# Altium project UmTRXv2.PRJPCB
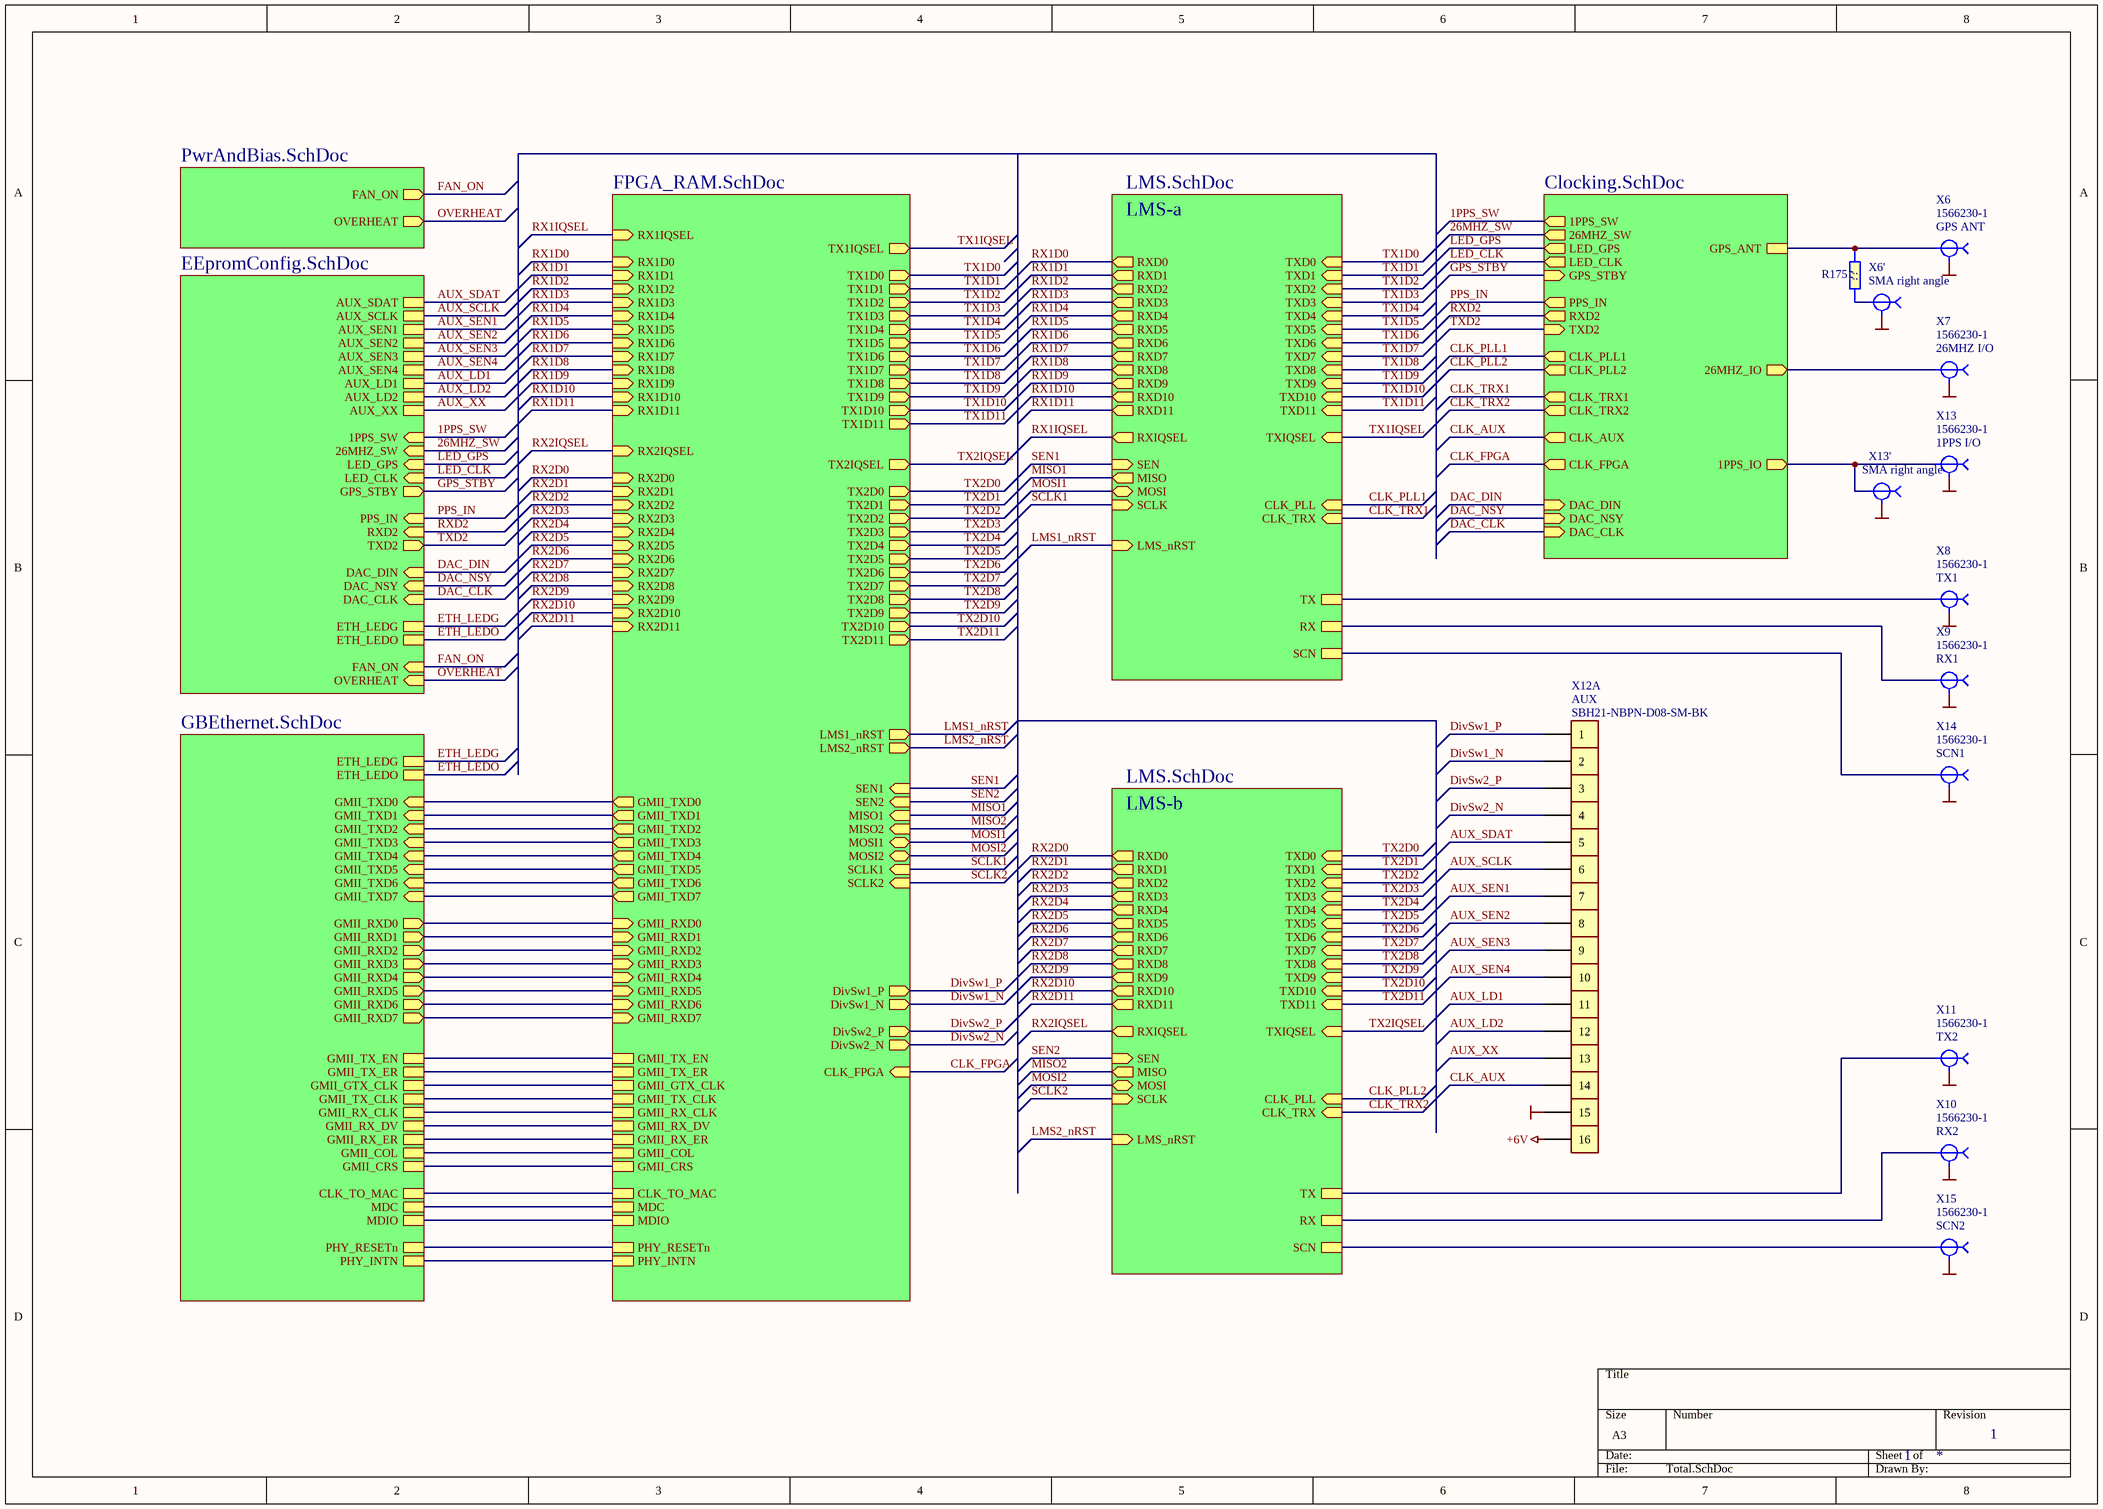
[diagram p0: Total.SchDoc]
3 sheets, 495 parts. Net scope: hierarchical (ports join the sheet entries above them; power ports are global).
Board file: UmTRXv2.PcbDoc
Sheets:
  Total.SchDoc
    PwrAndBias = PwrAndBias.SchDoc
    LMS-a = LMS.SchDoc
    LMS-b = LMS.SchDoc

## Sheet Total.SchDoc: USRP Cellular Tranceiver
size A3; Revision: 1; SheetNumber: 1; DocumentName: Fairwaves Co.

### Parts
R175  ??  [R0603-PHILLIPS]
X6  1566230-1  Dscription: GPS ANT  [U_FL]
X6'  SMA right angle  [SMA right angle]
X7  1566230-1  Dscription: 26MHZ I/O  [U_FL]
X8  1566230-1  Dscription: TX1  [U_FL]
X9  1566230-1  Dscription: RX1  [U_FL]
X10  1566230-1  Dscription: RX2  [U_FL]
X11  1566230-1  Dscription: TX2  [U_FL]
X12  SBH21-NBPN-D08-SM-BK  Misc: AUX  [SBH-16]  (parts A,B,C,D,E,F,G,H,I,J,K,L,M,N,O,P of 16)
X13  1566230-1  Dscription: 1PPS I/O  [U_FL]
X13'  SMA right angle  [SMA right angle]
X14  1566230-1  Dscription: SCN1  [U_FL]
X15  1566230-1  Dscription: SCN2  [U_FL]

### Sub-sheets
Clocking = Clocking.SchDoc (file not in this document): TXD2 (in), 26MHZ_IO (out), CLK_FPGA (out), CLK_TRX1 (out), GPS_ANT, DAC_DIN (in), DAC_NSY (in), DAC_CLK (in), PPS_IN (out), RXD2 (out), CLK_PLL1 (out), CLK_AUX (out), 1PPS_IO (out), CLK_PLL2 (out), CLK_TRX2 (out), 1PPS_SW (out), 26MHZ_SW (out), LED_GPS (out), LED_CLK (out), GPS_STBY (in)
EEpromConfig = EEpromConfig.SchDoc (file not in this document): PPS_IN (in), DAC_DIN (in), DAC_NSY (in), DAC_CLK (in), TXD2 (out), RXD2 (in), ETH_LEDG, ETH_LEDO, FAN_ON (in), OVERHEAT (in), AUX_SDAT, AUX_SCLK, AUX_SEN1, AUX_LD1, AUX_XX, AUX_SEN2, AUX_LD2, 1PPS_SW (in), 26MHZ_SW (in), LED_GPS (in), LED_CLK (in), AUX_SEN3, AUX_SEN4, GPS_STBY (out)
FPGA_RAM = FPGA_RAM.SchDoc (file not in this document): DivSw1_P (out), DivSw1_N (out), TX1IQSEL (out), TX2IQSEL (out), RX1IQSEL (in), RX2IQSEL (in), SEN1 (in), SEN2 (in), MISO1 (in), MOSI1 (bidir), SCLK1 (in), DivSw2_P (out), DivSw2_N (out), CLK_FPGA (in), CLK_TO_MAC, GMII_TX_EN, GMII_TX_ER, GMII_GTX_CLK, GMII_TX_CLK, GMII_RX_CLK, GMII_RX_DV, GMII_RX_ER, GMII_COL, GMII_CRS, MDIO, MDC, PHY_INTN, PHY_RESETn, MISO2 (in), MOSI2 (bidir), SCLK2 (in), LMS1_nRST (out), LMS2_nRST (out), TX1D0 (out), TX1D1 (out), TX1D2 (out), TX1D3 (out), TX1D4 (out), TX1D5 (out), TX1D6 (out), TX1D7 (out), TX1D8 (out), TX1D9 (out), TX1D10 (out), TX1D11 (out), TX2D0 (out), TX2D1 (out), TX2D2 (out), TX2D3 (out), TX2D4 (out), TX2D5 (out), TX2D6 (out), TX2D7 (out), TX2D8 (out), TX2D9 (out), TX2D10 (out), TX2D11 (out), RX1D0 (in), RX1D1 (in), RX1D2 (in), RX1D3 (in), RX1D4 (in), RX1D5 (in), RX1D6 (in), RX1D7 (in), RX1D8 (in), RX1D9 (in), RX1D10 (in), RX1D11 (in), RX2D0 (in), RX2D1 (in), RX2D2 (in), RX2D3 (in), RX2D4 (in), RX2D5 (in), RX2D6 (in), RX2D7 (in), RX2D8 (in), RX2D9 (in), RX2D10 (in), RX2D11 (in), GMII_TXD0 (out), GMII_TXD1 (out), GMII_TXD2 (out), GMII_TXD3 (out), GMII_TXD4 (out), GMII_TXD5 (out), GMII_TXD6 (out), GMII_TXD7 (out), GMII_RXD0 (in), GMII_RXD1 (in), GMII_RXD2 (in), GMII_RXD3 (in), GMII_RXD4 (in), GMII_RXD5 (in), GMII_RXD6 (in), GMII_RXD7 (in)
GBEthernet = GBEthernet.SchDoc (file not in this document): CLK_TO_MAC, GMII_TX_ER, GMII_TX_EN, GMII_GTX_CLK, GMII_RX_CLK, GMII_TX_CLK, GMII_RX_DV, GMII_RX_ER, GMII_COL, GMII_CRS, MDC, MDIO, PHY_INTN, PHY_RESETn, ETH_LEDG, GMII_TXD0 (in), GMII_TXD1 (in), GMII_TXD2 (in), GMII_TXD3 (in), GMII_TXD4 (in), GMII_TXD5 (in), GMII_TXD6 (in), GMII_TXD7 (in), GMII_RXD0 (out), GMII_RXD1 (out), GMII_RXD2 (out), GMII_RXD3 (out), GMII_RXD4 (out), GMII_RXD5 (out), GMII_RXD6 (out), GMII_RXD7 (out), ETH_LEDO
LMS-a = LMS.SchDoc: RXD0 (out), RXIQSEL (out), SEN (in), MISO (out), MOSI (bidir), SCLK (in), RXD1 (out), RXD2 (out), RXD3 (out), RXD4 (out), RXD5 (out), RXD6 (out), RXD7 (out), RXD8 (out), RXD9 (out), RXD10 (out), RXD11 (out), TXD0 (in), TXIQSEL (in), CLK_PLL (in), TXD1 (in), TXD2 (in), TXD3 (in), TXD4 (in), TXD5 (in), TXD6 (in), TXD7 (in), TXD8 (in), TXD9 (in), TXD10 (in), TXD11 (in), TX, RX, LMS_nRST (in), SCN, CLK_TRX (in)
LMS-b = LMS.SchDoc: RXD0 (out), RXIQSEL (out), SEN (in), MISO (out), MOSI (bidir), SCLK (in), RXD1 (out), RXD2 (out), RXD3 (out), RXD4 (out), RXD5 (out), RXD6 (out), RXD7 (out), RXD8 (out), RXD9 (out), RXD10 (out), RXD11 (out), TXD0 (in), TXIQSEL (in), CLK_PLL (in), TXD1 (in), TXD2 (in), TXD3 (in), TXD4 (in), TXD5 (in), TXD6 (in), TXD7 (in), TXD8 (in), TXD9 (in), TXD10 (in), TXD11 (in), TX, RX, LMS_nRST (in), CLK_TRX (in), SCN
PwrAndBias = PwrAndBias.SchDoc: FAN_ON (out), OVERHEAT (out)

### Nets
+6V: X12.16
GND: X6.2(GND) X6'.2(GND) X7.2(GND) X8.2(GND) X9.2(GND) X10.2(GND) X11.2(GND) X12.15 X13.2(GND) X13'.2(GND) X14.2(GND) X15.2(GND)
1PPS_SW: sheet EEpromConfig/1PPS_SW, sheet Clocking/1PPS_SW
26MHZ_SW: sheet EEpromConfig/26MHZ_SW, sheet Clocking/26MHZ_SW
AUX_LD1: X12.11 ; sheet EEpromConfig/AUX_LD1
AUX_LD2: X12.12 ; sheet EEpromConfig/AUX_LD2
AUX_SCLK: X12.6 ; sheet EEpromConfig/AUX_SCLK
AUX_SDAT: X12.5 ; sheet EEpromConfig/AUX_SDAT
AUX_SEN1: X12.7 ; sheet EEpromConfig/AUX_SEN1
AUX_SEN2: X12.8 ; sheet EEpromConfig/AUX_SEN2
AUX_SEN3: X12.9 ; sheet EEpromConfig/AUX_SEN3
AUX_SEN4: X12.10 ; sheet EEpromConfig/AUX_SEN4
AUX_XX: X12.13 ; sheet EEpromConfig/AUX_XX
CLK_AUX: X12.14 ; sheet Clocking/CLK_AUX
CLK_FPGA: sheet FPGA_RAM/CLK_FPGA, sheet Clocking/CLK_FPGA
CLK_PLL1: sheet Clocking/CLK_PLL1, sheet LMS-a/CLK_PLL
CLK_PLL2: sheet Clocking/CLK_PLL2, sheet LMS-b/CLK_PLL
CLK_TRX1: sheet Clocking/CLK_TRX1, sheet LMS-a/CLK_TRX
CLK_TRX2: sheet Clocking/CLK_TRX2, sheet LMS-b/CLK_TRX
DAC_CLK: sheet EEpromConfig/DAC_CLK, sheet Clocking/DAC_CLK
DAC_DIN: sheet EEpromConfig/DAC_DIN, sheet Clocking/DAC_DIN
DAC_NSY: sheet EEpromConfig/DAC_NSY, sheet Clocking/DAC_NSY
DivSw1_N: X12.2 ; sheet FPGA_RAM/DivSw1_N
DivSw1_P: X12.1 ; sheet FPGA_RAM/DivSw1_P
DivSw2_N: X12.4 ; sheet FPGA_RAM/DivSw2_N
DivSw2_P: X12.3 ; sheet FPGA_RAM/DivSw2_P
ETH_LEDG: sheet GBEthernet/ETH_LEDG, sheet EEpromConfig/ETH_LEDG
ETH_LEDO: sheet GBEthernet/ETH_LEDO, sheet EEpromConfig/ETH_LEDO
FAN_ON: sheet PwrAndBias/FAN_ON, sheet EEpromConfig/FAN_ON
GPS_STBY: sheet EEpromConfig/GPS_STBY, sheet Clocking/GPS_STBY
LED_CLK: sheet EEpromConfig/LED_CLK, sheet Clocking/LED_CLK
LED_GPS: sheet EEpromConfig/LED_GPS, sheet Clocking/LED_GPS
LMS1_nRST: sheet FPGA_RAM/LMS1_nRST, sheet LMS-a/LMS_nRST
LMS2_nRST: sheet FPGA_RAM/LMS2_nRST, sheet LMS-b/LMS_nRST
MISO1: sheet FPGA_RAM/MISO1, sheet LMS-a/MISO
MISO2: sheet FPGA_RAM/MISO2, sheet LMS-b/MISO
MOSI1: sheet FPGA_RAM/MOSI1, sheet LMS-a/MOSI
MOSI2: sheet FPGA_RAM/MOSI2, sheet LMS-b/MOSI
OVERHEAT: sheet PwrAndBias/OVERHEAT, sheet EEpromConfig/OVERHEAT
PPS_IN: sheet EEpromConfig/PPS_IN, sheet Clocking/PPS_IN
RX: X9.1 ; sheet LMS-a/RX
RX: X10.1 ; sheet LMS-b/RX  [a separate net that carries the same name]
RX1D0: sheet FPGA_RAM/RX1D0, sheet LMS-a/RXD0
RX1D1: sheet FPGA_RAM/RX1D1, sheet LMS-a/RXD1
RX1D2: sheet FPGA_RAM/RX1D2, sheet LMS-a/RXD2
RX1D3: sheet FPGA_RAM/RX1D3, sheet LMS-a/RXD3
RX1D4: sheet FPGA_RAM/RX1D4, sheet LMS-a/RXD4
RX1D5: sheet FPGA_RAM/RX1D5, sheet LMS-a/RXD5
RX1D6: sheet FPGA_RAM/RX1D6, sheet LMS-a/RXD6
RX1D7: sheet FPGA_RAM/RX1D7, sheet LMS-a/RXD7
RX1D8: sheet FPGA_RAM/RX1D8, sheet LMS-a/RXD8
RX1D9: sheet FPGA_RAM/RX1D9, sheet LMS-a/RXD9
RX1D10: sheet FPGA_RAM/RX1D10, sheet LMS-a/RXD10
RX1D11: sheet FPGA_RAM/RX1D11, sheet LMS-a/RXD11
RX1IQSEL: sheet FPGA_RAM/RX1IQSEL, sheet LMS-a/RXIQSEL
RX2D0: sheet FPGA_RAM/RX2D0, sheet LMS-b/RXD0
RX2D1: sheet FPGA_RAM/RX2D1, sheet LMS-b/RXD1
RX2D2: sheet FPGA_RAM/RX2D2, sheet LMS-b/RXD2
RX2D3: sheet FPGA_RAM/RX2D3, sheet LMS-b/RXD3
RX2D4: sheet FPGA_RAM/RX2D4, sheet LMS-b/RXD4
RX2D5: sheet FPGA_RAM/RX2D5, sheet LMS-b/RXD5
RX2D6: sheet FPGA_RAM/RX2D6, sheet LMS-b/RXD6
RX2D7: sheet FPGA_RAM/RX2D7, sheet LMS-b/RXD7
RX2D8: sheet FPGA_RAM/RX2D8, sheet LMS-b/RXD8
RX2D9: sheet FPGA_RAM/RX2D9, sheet LMS-b/RXD9
RX2D10: sheet FPGA_RAM/RX2D10, sheet LMS-b/RXD10
RX2D11: sheet FPGA_RAM/RX2D11, sheet LMS-b/RXD11
RX2IQSEL: sheet FPGA_RAM/RX2IQSEL, sheet LMS-b/RXIQSEL
RXD2: sheet EEpromConfig/RXD2, sheet Clocking/RXD2
SCLK1: sheet FPGA_RAM/SCLK1, sheet LMS-a/SCLK
SCLK2: sheet FPGA_RAM/SCLK2, sheet LMS-b/SCLK
SCN: X14.1 ; sheet LMS-a/SCN
SCN: X15.1 ; sheet LMS-b/SCN  [a separate net that carries the same name]
SEN1: sheet FPGA_RAM/SEN1, sheet LMS-a/SEN
SEN2: sheet FPGA_RAM/SEN2, sheet LMS-b/SEN
TX: X8.1 ; sheet LMS-a/TX
TX: X11.1 ; sheet LMS-b/TX  [a separate net that carries the same name]
TX1D0: sheet FPGA_RAM/TX1D0, sheet LMS-a/TXD0
TX1D1: sheet FPGA_RAM/TX1D1, sheet LMS-a/TXD1
TX1D2: sheet FPGA_RAM/TX1D2, sheet LMS-a/TXD2
TX1D3: sheet FPGA_RAM/TX1D3, sheet LMS-a/TXD3
TX1D4: sheet FPGA_RAM/TX1D4, sheet LMS-a/TXD4
TX1D5: sheet FPGA_RAM/TX1D5, sheet LMS-a/TXD5
TX1D6: sheet FPGA_RAM/TX1D6, sheet LMS-a/TXD6
TX1D7: sheet FPGA_RAM/TX1D7, sheet LMS-a/TXD7
TX1D8: sheet FPGA_RAM/TX1D8, sheet LMS-a/TXD8
TX1D9: sheet FPGA_RAM/TX1D9, sheet LMS-a/TXD9
TX1D10: sheet FPGA_RAM/TX1D10, sheet LMS-a/TXD10
TX1D11: sheet FPGA_RAM/TX1D11, sheet LMS-a/TXD11
TX1IQSEL: sheet FPGA_RAM/TX1IQSEL, sheet LMS-a/TXIQSEL
TX2D0: sheet FPGA_RAM/TX2D0, sheet LMS-b/TXD0
TX2D1: sheet FPGA_RAM/TX2D1, sheet LMS-b/TXD1
TX2D2: sheet FPGA_RAM/TX2D2, sheet LMS-b/TXD2
TX2D3: sheet FPGA_RAM/TX2D3, sheet LMS-b/TXD3
TX2D4: sheet FPGA_RAM/TX2D4, sheet LMS-b/TXD4
TX2D5: sheet FPGA_RAM/TX2D5, sheet LMS-b/TXD5
TX2D6: sheet FPGA_RAM/TX2D6, sheet LMS-b/TXD6
TX2D7: sheet FPGA_RAM/TX2D7, sheet LMS-b/TXD7
TX2D8: sheet FPGA_RAM/TX2D8, sheet LMS-b/TXD8
TX2D9: sheet FPGA_RAM/TX2D9, sheet LMS-b/TXD9
TX2D10: sheet FPGA_RAM/TX2D10, sheet LMS-b/TXD10
TX2D11: sheet FPGA_RAM/TX2D11, sheet LMS-b/TXD11
TX2IQSEL: sheet FPGA_RAM/TX2IQSEL, sheet LMS-b/TXIQSEL
TXD2: sheet EEpromConfig/TXD2, sheet Clocking/TXD2
NetR175_1: R175.1 X6'.1
NetR175_2: R175.2 X6.1 ; sheet Clocking/GPS_ANT
NetX7_1: X7.1 ; sheet Clocking/26MHZ_IO
NetX13_1: X13.1 X13'.1 ; sheet Clocking/1PPS_IO
(unnamed): sheet FPGA_RAM/CLK_TO_MAC, sheet GBEthernet/CLK_TO_MAC
(unnamed): sheet FPGA_RAM/GMII_TX_EN, sheet GBEthernet/GMII_TX_EN
(unnamed): sheet FPGA_RAM/GMII_TX_ER, sheet GBEthernet/GMII_TX_ER
(unnamed): sheet FPGA_RAM/GMII_GTX_CLK, sheet GBEthernet/GMII_GTX_CLK
(unnamed): sheet FPGA_RAM/GMII_TX_CLK, sheet GBEthernet/GMII_TX_CLK
(unnamed): sheet FPGA_RAM/GMII_RX_CLK, sheet GBEthernet/GMII_RX_CLK
(unnamed): sheet FPGA_RAM/GMII_RX_DV, sheet GBEthernet/GMII_RX_DV
(unnamed): sheet FPGA_RAM/GMII_RX_ER, sheet GBEthernet/GMII_RX_ER
(unnamed): sheet FPGA_RAM/GMII_COL, sheet GBEthernet/GMII_COL
(unnamed): sheet FPGA_RAM/GMII_CRS, sheet GBEthernet/GMII_CRS
(unnamed): sheet FPGA_RAM/MDIO, sheet GBEthernet/MDIO
(unnamed): sheet FPGA_RAM/MDC, sheet GBEthernet/MDC
(unnamed): sheet FPGA_RAM/PHY_INTN, sheet GBEthernet/PHY_INTN
(unnamed): sheet FPGA_RAM/PHY_RESETn, sheet GBEthernet/PHY_RESETn
(unnamed): sheet FPGA_RAM/GMII_TXD0, sheet GBEthernet/GMII_TXD0
(unnamed): sheet FPGA_RAM/GMII_TXD1, sheet GBEthernet/GMII_TXD1
(unnamed): sheet FPGA_RAM/GMII_TXD2, sheet GBEthernet/GMII_TXD2
(unnamed): sheet FPGA_RAM/GMII_TXD3, sheet GBEthernet/GMII_TXD3
(unnamed): sheet FPGA_RAM/GMII_TXD4, sheet GBEthernet/GMII_TXD4
(unnamed): sheet FPGA_RAM/GMII_TXD5, sheet GBEthernet/GMII_TXD5
(unnamed): sheet FPGA_RAM/GMII_TXD6, sheet GBEthernet/GMII_TXD6
(unnamed): sheet FPGA_RAM/GMII_TXD7, sheet GBEthernet/GMII_TXD7
(unnamed): sheet FPGA_RAM/GMII_RXD0, sheet GBEthernet/GMII_RXD0
(unnamed): sheet FPGA_RAM/GMII_RXD1, sheet GBEthernet/GMII_RXD1
(unnamed): sheet FPGA_RAM/GMII_RXD2, sheet GBEthernet/GMII_RXD2
(unnamed): sheet FPGA_RAM/GMII_RXD3, sheet GBEthernet/GMII_RXD3
(unnamed): sheet FPGA_RAM/GMII_RXD4, sheet GBEthernet/GMII_RXD4
(unnamed): sheet FPGA_RAM/GMII_RXD5, sheet GBEthernet/GMII_RXD5
(unnamed): sheet FPGA_RAM/GMII_RXD6, sheet GBEthernet/GMII_RXD6
(unnamed): sheet FPGA_RAM/GMII_RXD7, sheet GBEthernet/GMII_RXD7

### Library data of the parts
R175 = R0603: Резистор; Manufacturer: YAGEO; Tolerance: 5%; Name: SMD0603; U/P/TKE: 0.1W; Value: ??
X6-X11 X13-X15 = U_FL: Ultraminiature Coax Connector (UMCC); Manufacturer: Tyco Electronics Corp; Name: 1566230-1
X6' X13' = SMA-Right Angle: Разъем; Name: SMA right angle
X12 = SBH21-8x2_SMD: Connector 2mm SMD; Manufacturer: Sullins; Name: SBH21-NBPN-D08-SM-BK

## Sheet PwrAndBias.SchDoc: Pwr And Biasing
size A3; Revision: 1; SheetNumber: 8
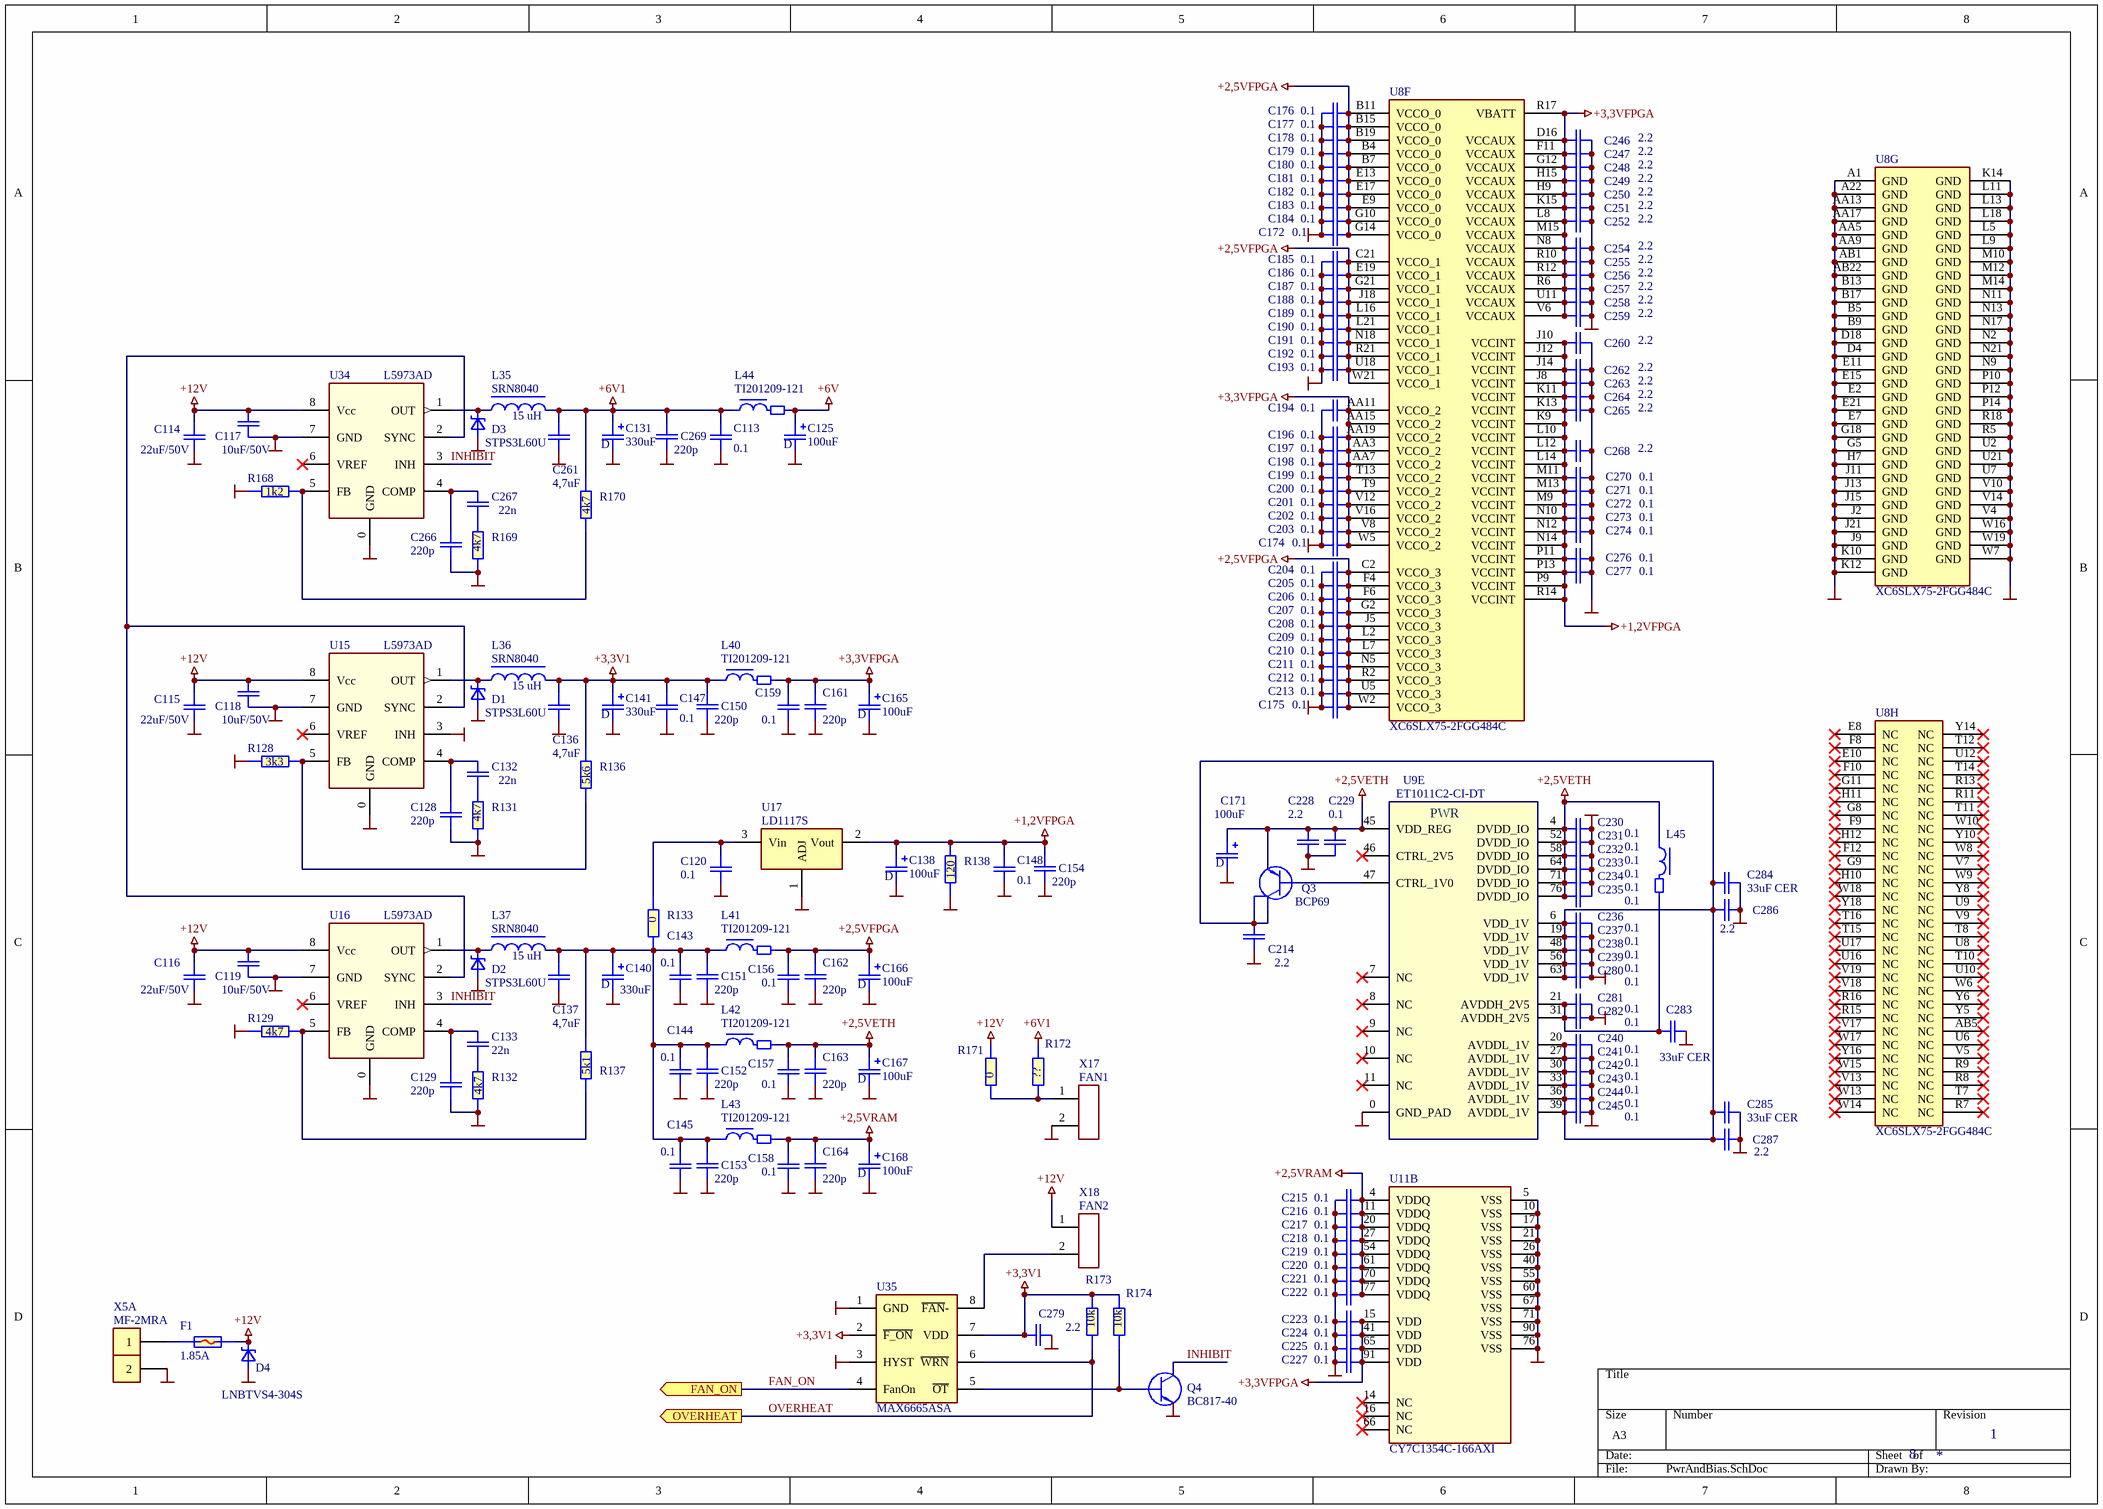
[diagram p1: PwrAndBias.SchDoc]

### Parts
C113  0.1  [C0402-Phillips]
C114  22uF/50V  [C2220]
C115  22uF/50V  [C2220]
C116  22uF/50V  [C2220]
C117  10uF/50V  [C1210_H2,5]
C118  10uF/50V  [C1210_H2,5]
C119  10uF/50V  [C1210_H2,5]
C120  0.1  [C0402-Phillips]
C125  100uF  [cd7343]
C128  220p  [C0603-PHILLIPS]
C129  220p  [C0603-PHILLIPS]
C131  330uF  [cd7343]
C132  22n  [C0603-PHILLIPS]
C133  22n  [C0603-PHILLIPS]
C136  4,7uF  [c1206]
C137  4,7uF  [c1206]
C138  100uF  [cd7343]
C140  330uF  [cd7343]
C141  330uF  [cd7343]
C143  0.1  [C0402-Phillips]
C144  0.1  [C0402-Phillips]
C145  0.1  [C0402-Phillips]
C147  0.1  [C0402-Phillips]
C148  0.1  [C0402-Phillips]
C150  220p  [C0603-PHILLIPS]
C151  220p  [C0603-PHILLIPS]
C152  220p  [C0603-PHILLIPS]
C153  220p  [C0603-PHILLIPS]
C154  220p  [C0603-PHILLIPS]
C156  0.1  [C0402-Phillips]
C157  0.1  [C0402-Phillips]
C158  0.1  [C0402-Phillips]
C159  0.1  [C0402-Phillips]
C161  220p  [C0603-PHILLIPS]
C162  220p  [C0603-PHILLIPS]
C163  220p  [C0603-PHILLIPS]
C164  220p  [C0603-PHILLIPS]
C165  100uF  [cd7343]
C166  100uF  [cd7343]
C167  100uF  [cd7343]
C168  100uF  [cd7343]
C171  100uF  [cd7343]
C172  0.1  [C0402-cirq]
C174  0.1  [C0402-cirq]
C175  0.1  [C0402-cirq]
C176  0.1  [C0402-cirq]
C177  0.1  [C0402-cirq]
C178  0.1  [C0402-cirq]
C179  0.1  [C0402-cirq]
C180  0.1  [C0402-cirq]
C181  0.1  [C0402-cirq]
C182  0.1  [C0402-cirq]
C183  0.1  [C0402-cirq]
C184  0.1  [C0402-cirq]
C185  0.1  [C0402-cirq]
C186  0.1  [C0402-cirq]
C187  0.1  [C0402-cirq]
C188  0.1  [C0402-cirq]
C189  0.1  [C0402-cirq]
C190  0.1  [C0402-cirq]
C191  0.1  [C0402-cirq]
C192  0.1  [C0402-cirq]
C193  0.1  [C0402-cirq]
C194  0.1  [C0402-cirq]
C196  0.1  [C0402-cirq]
C197  0.1  [C0402-cirq]
C198  0.1  [C0402-cirq]
C199  0.1  [C0402-cirq]
C200  0.1  [C0402-cirq]
C201  0.1  [C0402-cirq]
C202  0.1  [C0402-cirq]
C203  0.1  [C0402-cirq]
C204  0.1  [C0402-cirq]
C205  0.1  [C0402-cirq]
C206  0.1  [C0402-cirq]
C207  0.1  [C0402-cirq]
C208  0.1  [C0402-cirq]
C209  0.1  [C0402-cirq]
C210  0.1  [C0402-cirq]
C211  0.1  [C0402-cirq]
C212  0.1  [C0402-cirq]
C213  0.1  [C0402-cirq]
C214  2.2  [C0402-Phillips]
C215  0.1  [C0402-Phillips]
C216  0.1  [C0402-Phillips]
C217  0.1  [C0402-Phillips]
C218  0.1  [C0402-Phillips]
C219  0.1  [C0402-Phillips]
C220  0.1  [C0402-Phillips]
C221  0.1  [C0402-Phillips]
C222  0.1  [C0402-Phillips]
C223  0.1  [C0402-Phillips]
C224  0.1  [C0402-Phillips]
C225  0.1  [C0402-Phillips]
C227  0.1  [C0402-Phillips]
C228  2.2  [C0402-Phillips]
C229  0.1  [C0402-Phillips]
C230  0.1  [C0402-Phillips]
C231  0.1  [C0402-Phillips]
C232  0.1  [C0402-Phillips]
C233  0.1  [C0402-Phillips]
C234  0.1  [C0402-Phillips]
C235  0.1  [C0402-Phillips]
C236  0.1  [C0402-Phillips]
C237  0.1  [C0402-Phillips]
C238  0.1  [C0402-Phillips]
C239  0.1  [C0402-Phillips]
C240  0.1  [C0402-Phillips]
C241  0.1  [C0402-Phillips]
C242  0.1  [C0402-Phillips]
C243  0.1  [C0402-Phillips]
C244  0.1  [C0402-Phillips]
C245  0.1  [C0402-Phillips]
C246  2.2  [C0402-cirq]
C247  2.2  [C0402-cirq]
C248  2.2  [C0402-cirq]
C249  2.2  [C0402-cirq]
C250  2.2  [C0402-cirq]
C251  2.2  [C0402-cirq]
C252  2.2  [C0402-cirq]
C254  2.2  [C0402-cirq]
C255  2.2  [C0402-cirq]
C256  2.2  [C0402-cirq]
C257  2.2  [C0402-cirq]
C258  2.2  [C0402-cirq]
C259  2.2  [C0402-cirq]
C260  2.2  [C0402-cirq]
C261  4,7uF  [c1206]
C262  2.2  [C0402-cirq]
C263  2.2  [C0402-cirq]
C264  2.2  [C0402-cirq]
C265  2.2  [C0402-cirq]
C266  220p  [C0603-PHILLIPS]
C267  22n  [C0603-PHILLIPS]
C268  2.2  [C0402-cirq]
C269  220p  [C0603-PHILLIPS]
C270  0.1  [C0402-cirq]
C271  0.1  [C0402-cirq]
C272  0.1  [C0402-cirq]
C273  0.1  [C0402-cirq]
C274  0.1  [C0402-cirq]
C276  0.1  [C0402-cirq]
C277  0.1  [C0402-cirq]
C279  2.2  [C0402-Phillips]
C280  0.1  [C0402-Phillips]
C281  0.1  [C0402-Phillips]
C282  0.1  [C0402-Phillips]
C283  33uF CER  [C0805-Phillips]
C284  33uF CER  [C0805-Phillips]
C285  33uF CER  [C0805-Phillips]
C286  2.2  [C0402-Phillips]
C287  2.2  [C0402-Phillips]
D1  STPS3L60U  [SMB]
D2  STPS3L60U  [SMB]
D3  STPS3L60U  [SMB]
D4  LNBTVS4-304S  [SMC]
F1  1.85A  [FUSE2920]
L35  15 uH  [SRN8040]
L36  15 uH  [SRN8040]
L37  15 uH  [SRN8040]
L40  TI201209-121  [TI2012-Phillips]
L41  TI201209-121  [TI2012-Phillips]
L42  TI201209-121  [TI2012-Phillips]
L43  TI201209-121  [TI2012-Phillips]
L44  TI201209-121  [TI2012-Phillips]
L45  TI160808U601  [Ti160808-Phillips]  (value not drawn)
Q3  BCP69  [SOT-223]
Q4  BC817-40  [SOT23-Philips]
R128  3k3  [R0603-PHILLIPS]
R129  4k7  [R0603-PHILLIPS]
R131  4k7  [R0603-PHILLIPS]
R132  4k7  [R0603-PHILLIPS]
R133  0  [R0603-PHILLIPS]
R136  5k6  [R0603-PHILLIPS]
R137  5k1  [R0603-PHILLIPS]
R138  120  [R0603-PHILLIPS]
R168  1k2  [R0603-PHILLIPS]
R169  4k7  [R0603-PHILLIPS]
R170  4k7  [R0603-PHILLIPS]
R171  0  [R0603-PHILLIPS]
R172  ??  [R0603-PHILLIPS]
R173  10k  [R0603-PHILLIPS]
R174  10k  [R0603-PHILLIPS]
U8  XC6SLX75-2FGG484C  [FBGA484]  (parts F,G,H of 8)
U9  ET1011C2-CI-DT  [QFN-84(10x10/0/4mm)with_pad]  (part E of 5)
U11  CY7C1354C-166AXI  [QFP-10020X14/0.65]]  (part B of 2)
U15  L5973AD  [SOIC8 - BackGND - 0.4mm dia]
U16  L5973AD  [SOIC8 - BackGND - 0.4mm dia]
U17  LD1117S  [SOT-223-1]
U34  L5973AD  [SOIC8 - BackGND - 0.4mm dia]
U35  MAX6665ASA  [SO-8]
X5  MF-2MRA  [MF-2MRA]  (parts A,B of 2)
X17  FAN1  [WF-2]
X18  FAN2  [WF-2]

### Ports
FAN_ON (out), OVERHEAT (out)

### Nets
+1,2VFPGA: C138.1(+) C148.1 C154.1 C260.1 C262.1 C263.1 C264.1 C265.1 C268.1 C270.1 C271.1 C272.1 C273.1 C274.1 C276.1 C277.1 R138.1 U8.J8(VCCINT) U8.J10(VCCINT) U8.J12(VCCINT) U8.J14(VCCINT) U8.K9(VCCINT) U8.K11(VCCINT) U8.K13(VCCINT) U8.L10(VCCINT) U8.L12(VCCINT) U8.L14(VCCINT) U8.M9(VCCINT) U8.M11(VCCINT) U8.M13(VCCINT) U8.N10(VCCINT) U8.N12(VCCINT) U8.N14(VCCINT) U8.P9(VCCINT) U8.P11(VCCINT) U8.P13(VCCINT) U8.R14(VCCINT) U17.2(Vout)
+2,5VETH: C157.1 C163.1 C167.1(+) C171.1(+) C228.2 C229.1 C230.1 C231.1 C232.1 C233.1 C234.1 C235.1 L42.2 L45.1 Q3.3(E) U9.4(DVDD_IO) U9.45(VDD_REG) U9.52(DVDD_IO) U9.58(DVDD_IO) U9.64(DVDD_IO) U9.71(DVDD_IO) U9.76(DVDD_IO)
+2,5VFPGA: C156.1 C162.1 C166.1(+) C172.2 C175.2 C176.2 C177.2 C178.2 C179.2 C180.2 C181.2 C182.2 C183.2 C184.2 C185.2 C186.2 C187.2 C188.2 C189.2 C190.2 C191.2 C192.2 C193.2 C204.2 C205.2 C206.2 C207.2 C208.2 C209.2 C210.2 C211.2 C212.2 C213.2 L41.2 U8.B4(VCCO_0) U8.B7(VCCO_0) U8.B11(VCCO_0) U8.B15(VCCO_0) U8.B19(VCCO_0) U8.C2(VCCO_3) U8.C21(VCCO_1) U8.E9(VCCO_0) U8.E13(VCCO_0) U8.E17(VCCO_0) U8.E19(VCCO_1) U8.F4(VCCO_3) U8.F6(VCCO_3) U8.G2(VCCO_3) U8.G10(VCCO_0) U8.G14(VCCO_0) U8.G21(VCCO_1) U8.J5(VCCO_3) U8.J18(VCCO_1) U8.L2(VCCO_3) U8.L7(VCCO_3) U8.L16(VCCO_1) U8.L21(VCCO_1) U8.N5(VCCO_3) U8.N18(VCCO_1) U8.R2(VCCO_3) U8.R21(VCCO_1) U8.U5(VCCO_3) U8.U18(VCCO_1) U8.W2(VCCO_3) U8.W21(VCCO_1)
+2,5VRAM: C158.1 C164.1 C168.1(+) C215.2 C216.2 C217.2 C218.2 C219.2 C220.2 C221.2 C222.2 L43.2 U11.4(VDDQ) U11.11(VDDQ) U11.20(VDDQ) U11.27(VDDQ) U11.54(VDDQ) U11.61(VDDQ) U11.70(VDDQ) U11.77(VDDQ)
+3,3V1: C136.1 C141.1(+) C147.1 C150.1 C279.1 L36.2 L40.1 R136.1 R173.1 R174.1 U35.2(~{F_ON}) U35.7(VDD)
+3,3VFPGA: C159.1 C161.1 C165.1(+) C174.2 C194.2 C196.2 C197.2 C198.2 C199.2 C200.2 C201.2 C202.2 C203.2 C223.2 C224.2 C225.2 C227.2 C246.1 C247.1 C248.1 C249.1 C250.1 C251.1 C252.1 C254.1 C255.1 C256.1 C257.1 C258.1 C259.1 L40.2 U8.AA3(VCCO_2) U8.AA7(VCCO_2) U8.AA11(VCCO_2) U8.AA15(VCCO_2) U8.AA19(VCCO_2) U8.D16(VCCAUX) U8.F11(VCCAUX) U8.G12(VCCAUX) U8.H9(VCCAUX) U8.H15(VCCAUX) U8.K15(VCCAUX) U8.L8(VCCAUX) U8.M15(VCCAUX) U8.N8(VCCAUX) U8.R6(VCCAUX) U8.R10(VCCAUX) U8.R12(VCCAUX) U8.R17(VBATT) U8.T9(VCCO_2) U8.T13(VCCO_2) U8.U11(VCCAUX) U8.V6(VCCAUX) U8.V8(VCCO_2) U8.V12(VCCO_2) U8.V16(VCCO_2) U8.W5(VCCO_2) U11.15(VDD) U11.41(VDD) U11.65(VDD) U11.91(VDD)
+6V: C125.1(+) L44.2
+6V1: C113.1 C131.1(+) C261.1 C269.1 L35.2 L44.1 R170.1 R172.1
+12V: C114.1 C115.1 C116.1 C117.1 C118.1 C119.1 D4.2(C) F1.2 R171.1 U15.8(Vcc) U16.8(Vcc) U34.8(Vcc) X18.1
GND: C113.2 C114.2 C115.2 C116.2 C117.2 C118.2 C119.2 C120.2 C125.2(-) C128.2 C129.2 C131.2(-) C136.2 C137.2 C138.2(-) C140.2(-) C141.2(-) C143.2 C144.2 C145.2 C147.2 C148.2 C150.2 C151.2 C152.2 C153.2 C154.2 C156.2 C157.2 C158.2 C159.2 C161.2 C162.2 C163.2 C164.2 C165.2(-) C166.2(-) C167.2(-) C168.2(-) C171.2(-) C172.1 C174.1 C175.1 C176.1 C177.1 C178.1 C179.1 C180.1 C181.1 C182.1 C183.1 C184.1 C185.1 C186.1 C187.1 C188.1 C189.1 C190.1 C191.1 C192.1 C193.1 C194.1 C196.1 C197.1 C198.1 C199.1 C200.1 C201.1 C202.1 C203.1 C204.1 C205.1 C206.1 C207.1 C208.1 C209.1 C210.1 C211.1 C212.1 C213.1 C214.1 C215.1 C216.1 C217.1 C218.1 C219.1 C220.1 C221.1 C222.1 C223.1 C224.1 C225.1 C227.1 C228.1 C229.2 C230.2 C231.2 C232.2 C233.2 C234.2 C235.2 C236.2 C237.2 C238.2 C239.2 C240.2 C241.2 C242.2 C243.2 C244.2 C245.2 C246.2 C247.2 C248.2 C249.2 C250.2 C251.2 C252.2 C254.2 C255.2 C256.2 C257.2 C258.2 C259.2 C260.2 C261.2 C262.2 C263.2 C264.2 C265.2 C266.2 C268.2 C269.2 C270.2 C271.2 C272.2 C273.2 C274.2 C276.2 C277.2 C279.2 C280.2 C281.2 C282.2 C283.2 C284.2 C285.2 C286.1 C287.1 D1.2(A) D2.2(A) D3.2(A) D4.1(A) Q4.2(E) R128.1 R129.1 R131.2 R132.2 R138.2 R168.1 R169.2 U8.A1(GND) U8.A22(GND) U8.AA5(GND) U8.AA9(GND) U8.AA13(GND) U8.AA17(GND) U8.AB1(GND) U8.AB22(GND) U8.B5(GND) U8.B9(GND) U8.B13(GND) U8.B17(GND) U8.D4(GND) U8.D18(GND) U8.E2(GND) U8.E7(GND) U8.E11(GND) U8.E15(GND) U8.E21(GND) U8.G5(GND) U8.G18(GND) U8.H7(GND) U8.J2(GND) U8.J9(GND) U8.J11(GND) U8.J13(GND) U8.J15(GND) U8.J21(GND) U8.K10(GND) U8.K12(GND) U8.K14(GND) U8.L5(GND) U8.L9(GND) U8.L11(GND) U8.L13(GND) U8.L18(GND) U8.M10(GND) U8.M12(GND) U8.M14(GND) U8.N2(GND) U8.N9(GND) U8.N11(GND) U8.N13(GND) U8.N17(GND) U8.N21(GND) U8.P10(GND) U8.P12(GND) U8.P14(GND) U8.R5(GND) U8.R18(GND) U8.U2(GND) U8.U7(GND) U8.U21(GND) U8.V4(GND) U8.V10(GND) U8.V14(GND) U8.W7(GND) U8.W16(GND) U8.W19(GND) U9.0(GND_PAD) U11.5(VSS) U11.10(VSS) U11.17(VSS) U11.21(VSS) U11.26(VSS) U11.40(VSS) U11.55(VSS) U11.60(VSS) U11.67(VSS) U11.71(VSS) U11.76(VSS) U11.90(VSS) U15.0(GND) U15.3(INH) U15.7(GND) U16.0(GND) U16.7(GND) U17.1(ADJ) U34.0(GND) U34.7(GND) U35.1(GND) U35.3(HYST) X5.2 X17.2
FAN_ON: U35.4(FanOn) ; port FAN_ON
INHIBIT: Q4.3(C) U16.3(INH) U34.3(INH)
OVERHEAT: R173.2 U35.6(~{WRN}) ; port OVERHEAT
NetC120_1: C120.1 R133.2 U17.3(Vin)
NetC128_1: C128.1 C132.1 U15.4(COMP)
NetC129_1: C129.1 C133.1 U16.4(COMP)
NetC132_2: C132.2 R131.1
NetC133_2: C133.2 R132.1
NetC137_1: C137.1 C140.1(+) C143.1 C144.1 C145.1 C151.1 C152.1 C153.1 L37.2 L41.1 L42.1 L43.1 R133.1 R137.1
NetC214_2: C214.2 C236.1 C237.1 C238.1 C239.1 C240.1 C241.1 C242.1 C243.1 C244.1 C245.1 C280.1 C284.1 C285.1 C286.2 C287.2 Q3.2(C) Q3.4(C) U9.6(VDD_1V) U9.19(VDD_1V) U9.20(AVDDL_1V) U9.27(AVDDL_1V) U9.30(AVDDL_1V) U9.33(AVDDL_1V) U9.36(AVDDL_1V) U9.39(AVDDL_1V) U9.48(VDD_1V) U9.56(VDD_1V) U9.63(VDD_1V)
NetC266_1: C266.1 C267.1 U34.4(COMP)
NetC267_2: C267.2 R169.1
NetC281_1: C281.1 C282.1 C283.1 L45.2 U9.21(AVDDH_2V5) U9.31(AVDDH_2V5)
NetD1_1: D1.1(C) L36.1 U15.1(OUT)
NetD2_1: D2.1(C) L37.1 U16.1(OUT)
NetD3_1: D3.1(C) L35.1 U34.1(OUT)
NetF1_1: F1.1 X5.1
NetQ3_1: Q3.1(B) U9.47(CTRL_1V0)
NetQ4_1: Q4.1(B) R174.2 U35.5(~{OT})
NetR128_2: R128.2 R136.2 U15.5(FB)
NetR129_2: R129.2 R137.2 U16.5(FB)
NetR168_2: R168.2 R170.2 U34.5(FB)
NetR171_2: R171.2 R172.2 X17.1
NetU15_2: U15.2(SYNC) U16.2(SYNC) U34.2(SYNC)
NetU35_8: U35.8(~{FAN}-) X18.2

Not connected (* = marked no-connect by the designer): U8 AB5(NC)* E8(NC)* E10(NC)* F8(NC)* F9(NC)* F10(NC)* F12(NC)* G8(NC)* G9(NC)* G11(NC)* H10(NC)* H11(NC)* H12(NC)* R7(NC)* R8(NC)* R9(NC)* R11(NC)* R13(NC)* R15(NC)* R16(NC)* T7(NC)* T8(NC)* T10(NC)* T11(NC)* T12(NC)* T14(NC)* T15(NC)* T16(NC)* U6(NC)* U8(NC)* U9(NC)* U10(NC)* U12(NC)* U16(NC)* U17(NC)* V5(NC)* V7(NC)* V9(NC)* V13(NC)* V17(NC)* V18(NC)* V19(NC)* W6(NC)* W8(NC)* W9(NC)* W10(NC)* W13(NC)* W14(NC)* W15(NC)* W17(NC)* W18(NC)* Y5(NC)* Y6(NC)* Y8(NC)* Y10(NC)* Y14(NC)* Y16(NC)* Y18(NC)*; U9 7(NC)* 8(NC)* 9(NC)* 10(NC)* 11(NC)* 46(CTRL_2V5)*; U11 14(NC)* 16(NC)* 66(NC)*; U15 6(VREF)*; U16 6(VREF)*; U34 6(VREF)*

### Notes on the sheet
- (in symbol CD7343) D
- (in symbol ET1011C2-CI-DT, part E) PWR

### Library data of the parts
C113 C120 C143-C145 C147 C148 C156-C159 C172 C174-C194 C196-C225 C227-C252 C254-C260 C262-C265 C268 C270-C274 C276 C277 C279-C282 C286 C287 = C0402: Конденсатор; Manufacturer: MURATA; Tolerance: 20%; Name: SMD0402; U/P/TKE: Y5V
  C113 C120 C143-C145 C147 C148 C156-C159 C172 C174-C194 C196-C213 C215-C225 C227 C229-C245 C270-C274 C276 C277 C280-C282: Value: 0.1
  C214 C228 C246-C252 C254-C260 C262-C265 C268 C279 C286 C287: Value: 2.2
C114-C116 = C2220: Конденсатор; Manufacturer: TDK; Name: C5750Y5V1H226Z; U/P/TKE: Y5V; Value: 22uF/50V
C117-C119 = C1210_H2,5: Конденсатор; Manufacturer: TAIYO YUDEN; Tolerance: 20%; Name: UMK325 BJ106MM; U/P/TKE: X5R; Value: 10uF/50V
C125 C138 C165-C168 C171 = CD7343: Конденсатор; Manufacturer: SPRAGUE; Name: CASE-D; U/P/TKE: 16V; Value: 100uF
C128 C129 C150-C154 C161-C164 C266 C269 = C0603: Конденсатор; Manufacturer: MURATA; Tolerance: 20%; Name: SMD0603; U/P/TKE: NP0; Value: 220p
C131 C140 C141 = CD7343: Конденсатор; Manufacturer: Kemet; Name: CASE-D; U/P/TKE: 10V; Value: 330uF
C132 C133 C267 = C0603: Конденсатор; Manufacturer: MURATA; Tolerance: 20%; Name: SMD0603; U/P/TKE: X7R; Value: 22n
C136 C137 C261 = C1206: Конденсатор; Manufacturer: Taiyo Yuden; Tolerance: 10%; Name: UMK316AB7475KL-T; U/P/TKE: Y5V 50V; Value: 4,7uF
C283-C285 = C0805: Конденсатор; Manufacturer: MURATA; Tolerance: 20%; Name: SMD0805; U/P/TKE: Y5R; Value: 33uF CER
D1-D3 = B3x0B: Диод Шоттки; Manufacturer: ST; Name: STPS3L60U
D4 = STPS3L40S: Диод; Manufacturer: ST; Misc: TVS 30V 2.5kW; Name: LNBTVS4-304S
F1 = FUSE_PTC: FUSE PTC resetable; Manufacturer: Bel Fuse; Name: 0ZCD0185FF2C; U/P/TKE: 33V; Value: 1.85A
L35-L37 = L-SRN8040: Индуктивность; Manufacturer: BOURNS; Name: SRN8040; Value: 15 uH
L40-L44 = TI2012_1: Дроссель ЭМС; Manufacturer: MURATA; Name: TI201209-121; Value: *
L45 = TI160808: Дроссель ЭМС; Manufacturer: MURATA; Name: TI160808U601; Value: *
Q3 = BCP69: Транзистор; Manufacturer: INFINEON; Name: BCP69
Q4 = BC 817: Транзистор; Manufacturer: Philips; Name: BC817-40
R128 R129 R131-R133 R136-R138 R168-R174 = R0603: as R175 on sheet Total
  R128: Value: 3k3
  R129 R131 R132 R169 R170: Value: 4k7
  R133 R171: Value: 0
  R136: Value: 5k6
  R137: Value: 5k1
  R138: Value: 120
  R168: Value: 1k2
  R172: Value: ??
  R173 R174: Value: 10k
U8 = XC6SLX75-2FGG484C: Spartan-6 LX 1.2V FPGA, 270 User I/Os, 484-Ball Fine-Pitch BGA (1.0mm Pitch), Speed Grade 2, Commercial Grade, Pb-Free; Manufacturer: Xilinx; Published: 1-Jul-2010; Supplier 1: Digi-Key; Supplier Part Number 1: XC6SLX75-2FGG484C-ND; ComponentLink1Description: Manufacturer Link; ComponentLink1URL: http://www.xilinx.com; ComponentLink2Description: Spartan-6 Datasheet; ComponentLink2URL: http://www.xilinx.com/support/documentation/data_sheets/ds160.pdf; ComponentLink3Description: Spartan-6 Documents; ComponentLink3URL: http://www.xilinx.com/support/documentation/spartan-6.htm; ComponentLink4Description: Xilinx.com Home; ComponentLink4URL: http://www.xilinx.com; Misc: Spartan-6 LX 1.2V FPGA; Name: XC6SLX75-2FGG484C
U9 = ET1011C2-CI-DT: Микросхема; Manufacturer: LSI; PDF: d:\Proj\Components\LSI\Si5330.pdf; Misc: Gigabit Ethernet Transceiver; Name: ET1011C2-CI-DT
U11 = CY7C1354C-166AXI: Микросхема; Manufacturer: Cypress; Misc: Pipelined SRAM with NoBL™ Architecture; PDF: d:\Proj\Components\Cypress\CY7C1354C_CY7C1356C2.pdf; Name: CY7C1354C-166AXI
U15 U16 U34 = L5973D: Микросхема; Manufacturer: ST; Misc: step down switching regulator; Swap: No; PDF: d:\Proj\Components\ST\L5973D(stepdown2,5A)_ST.pdf; Name: L5973AD
U17 = LD1117ADJ: Микросхема; Manufacturer: STMicro; Swap: No; Name: LD1117S
U35 = MAX6665ASA: Микросхема; Manufacturer: Maxim; Swap: No; PDF: d:\Proj\Components\Maxim\MAX6665.pdf; Misc: Fan Controller/Driver; Name: MAX6665ASA
X5 = MF-2MRA: Разъем; Manufacturer: BM; Name: MF-2MRA
X17 X18 = WF-2: Разъем; Manufacturer: BM
  X17: Name: FAN1
  X18: Name: FAN2

## Sheet LMS.SchDoc
size A3; Revision: 1; SheetNumber: 3
Used 2 times, as channels LMS-a, LMS-b. Parts and nets are listed once, with the designators drawn on the sheet.
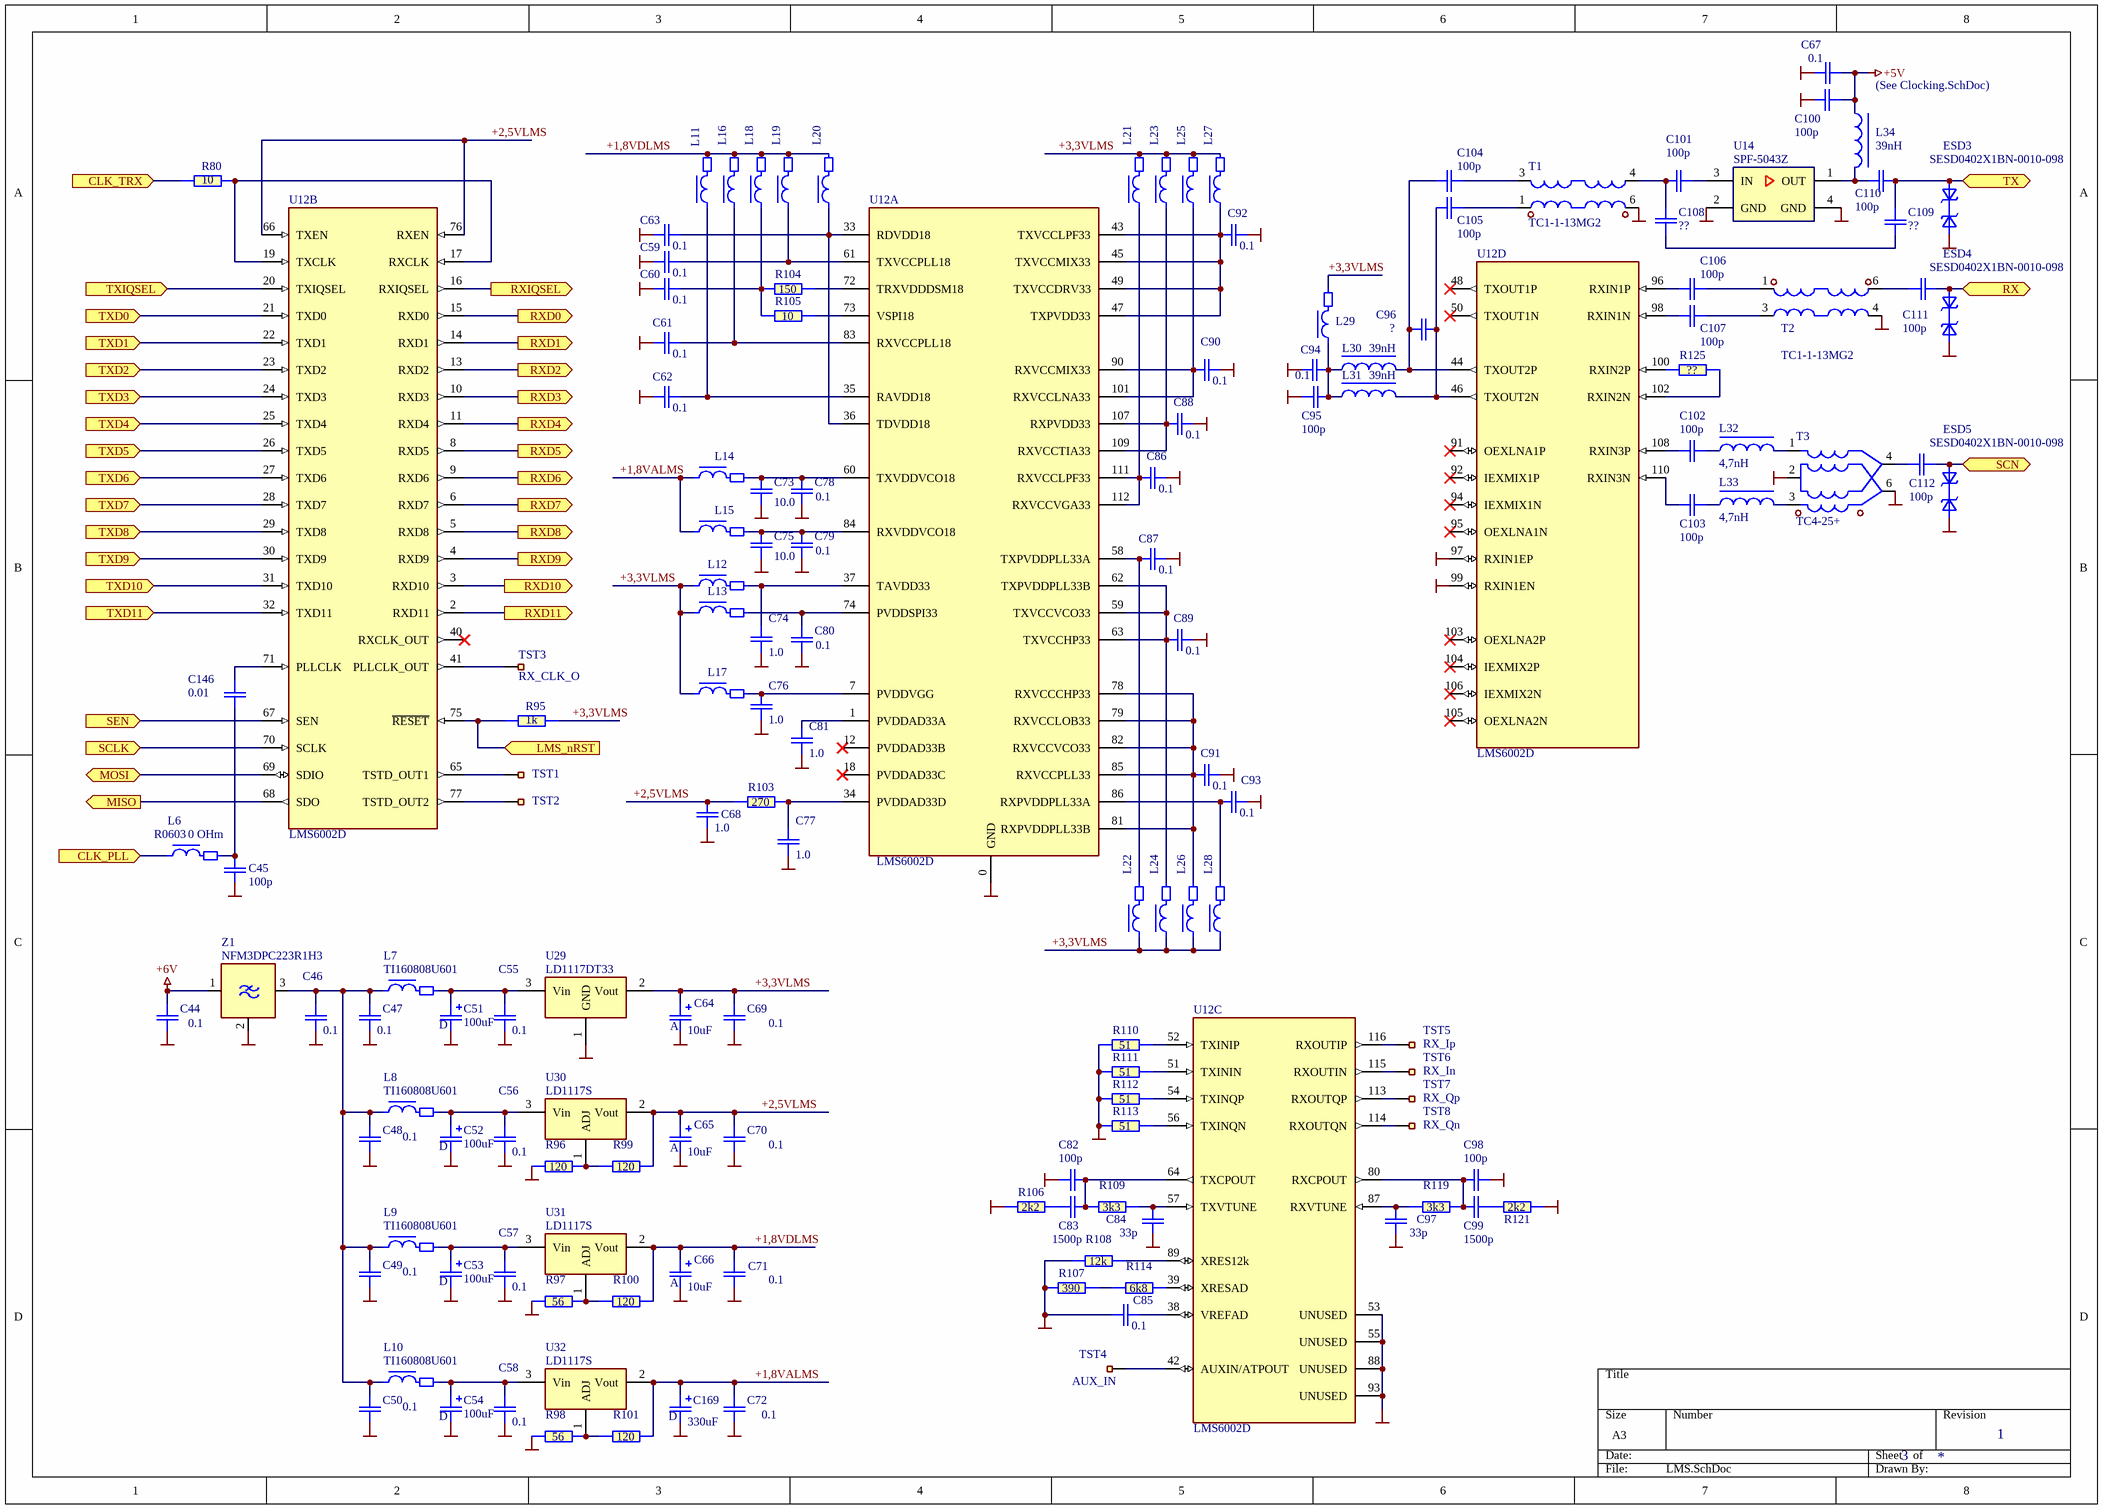
[diagram p2: LMS.SchDoc]

### Parts
C44  0.1  [C0402-Phillips]
C45  100p  [C0603-PHILLIPS]
C46  0.1  [C0402-Phillips]
C47  0.1  [C0402-Phillips]
C48  0.1  [C0402-Phillips]
C49  0.1  [C0402-Phillips]
C50  0.1  [C0402-Phillips]
C51  100uF  [cd7343]
C52  100uF  [cd7343]
C53  100uF  [cd7343]
C54  100uF  [cd7343]
C55  0.1  [C0402-Phillips]
C56  0.1  [C0402-Phillips]
C57  0.1  [C0402-Phillips]
C58  0.1  [C0402-Phillips]
C59  0.1  [C0402-Phillips]
C60  0.1  [C0402-Phillips]
C61  0.1  [C0402-Phillips]
C62  0.1  [C0402-Phillips]
C63  0.1  [C0402-Phillips]
C64  10uF  [CA3216]
C65  10uF  [CA3216]
C66  10uF  [CA3216]
C67  0.1  [C0402-Phillips]
C68  1.0  [C0603-PHILLIPS]
C69  0.1  [C0402-Phillips]
C70  0.1  [C0402-Phillips]
C71  0.1  [C0402-Phillips]
C72  0.1  [C0402-Phillips]
C73  10.0  [C0603-Phillips]
C74  1.0  [C0603-PHILLIPS]
C75  10.0  [C0603-Phillips]
C76  1.0  [C0603-PHILLIPS]
C77  1.0  [C0603-PHILLIPS]
C78  0.1  [C0402-Phillips]
C79  0.1  [C0402-cirq]
C80  0.1  [C0402-cirq]
C81  1.0  [C0603-PHILLIPS]
C82  100p  [C0603-PHILLIPS]
C83  1500p  [C0603-PHILLIPS]
C84  33p  [C0603-PHILLIPS]
C85  0.1  [C0402-Phillips]
C86  0.1  [C0402-Phillips]
C87  0.1  [C0402-Phillips]
C88  0.1  [C0402-cirq]
C89  0.1  [C0402-cirq]
C90  0.1  [C0402-Phillips]
C91  0.1  [C0402-Phillips]
C92  0.1  [C0402-cirq]
C93  0.1  [C0402-Phillips]
C94  0.1  [C0402-Phillips]
C95  100p  [C0603-PHILLIPS]
C96  ?  [C0603-PHILLIPS]
C97  33p  [C0603-PHILLIPS]
C98  100p  [C0603-PHILLIPS]
C99  1500p  [C0603-PHILLIPS]
C100  100p  [C0603-PHILLIPS]
C101  100p  [C0603-PHILLIPS]
C102  100p  [C0603-PHILLIPS]
C103  100p  [C0603-PHILLIPS]
C104  100p  [C0603-PHILLIPS]
C105  100p  [C0603-PHILLIPS]
C106  100p  [C0603-PHILLIPS]
C107  100p  [C0603-PHILLIPS]
C108  ??  [C0603-PHILLIPS]
C109  ??  [C0603-PHILLIPS]
C110  100p  [C0603-PHILLIPS]
C111  100p  [C0603-PHILLIPS]
C112  100p  [C0603-PHILLIPS]
C146  0.01  [C0603-PHILLIPS]
C169  330uF  [cd7343]
ESD3  SESD0402X1BN-0010-098  [R0402-Phillips]
ESD4  SESD0402X1BN-0010-098  [R0402-Phillips]
ESD5  SESD0402X1BN-0010-098  [R0402-Phillips]
L6  R0603  value 0 OHm  [Ti160808-Phillips]
L7  TI160808U601  [Ti160808-Phillips]
L8  TI160808U601  [Ti160808-Phillips]
L9  TI160808U601  [Ti160808-Phillips]
L10  TI160808U601  [Ti160808-Phillips]
L11  TI160808U601  [Ti160808-Phillips]  (value not drawn)
L12  TI160808U601  [Ti160808-Phillips]  (value not drawn)
L13  TI160808U601  [Ti160808-Phillips]  (value not drawn)
L14  TI160808U601  [Ti160808-Phillips]  (value not drawn)
L15  TI160808U601  [Ti160808-Phillips]  (value not drawn)
L16  TI160808U601  [Ti160808-Phillips]  (value not drawn)
L17  TI160808U601  [Ti160808-Phillips]  (value not drawn)
L18  TI160808U601  [Ti160808-Phillips]  (value not drawn)
L19  TI160808U601  [Ti160808-Phillips]  (value not drawn)
L20  TI160808U601  [Ti160808-Phillips]  (value not drawn)
L21  TI160808U601  [Ti160808-Phillips]  (value not drawn)
L22  TI160808U601  [Ti160808-Phillips]  (value not drawn)
L23  TI160808U601  [Ti160808-Phillips]  (value not drawn)
L24  TI160808U601  [Ti160808-Phillips]  (value not drawn)
L25  TI160808U601  [Ti160808-Phillips]  (value not drawn)
L26  TI160808U601  [Ti160808-Phillips]  (value not drawn)
L27  TI160808U601  [Ti160808-Phillips]  (value not drawn)
L28  TI160808U601  [Ti160808-Phillips]  (value not drawn)
L29  TI160808U601  [Ti160808-Phillips]  (value not drawn)
L30  39nH  [TF160808-Phillips]
L31  39nH  [TF160808-Phillips]
L32  4,7nH  [TF160808-Phillips]
L33  4,7nH  [TF160808-Phillips]
L34  39nH  [TF160808-Phillips]
R80  10  [R0603-PHILLIPS]
R95  1k  [R0603-PHILLIPS]
R96  120  [R0603-PHILLIPS]
R97  56  [R0603-PHILLIPS]
R98  56  [R0603-PHILLIPS]
R99  120  [R0603-PHILLIPS]
R100  120  [R0603-PHILLIPS]
R101  120  [R0603-PHILLIPS]
R103  270  [R0603-PHILLIPS]
R104  150  [R0603-PHILLIPS]
R105  10  [R0603-PHILLIPS]
R106  2k2  [R0603-PHILLIPS]
R107  390  [R0603-PHILLIPS]
R108  12k  [R0603-PHILLIPS]
R109  3k3  [R0603-PHILLIPS]
R110  51  [R0603-PHILLIPS]
R111  51  [R0603-PHILLIPS]
R112  51  [R0603-PHILLIPS]
R113  51  [R0603-PHILLIPS]
R114  6k8  [R0603-PHILLIPS]
R119  3k3  [R0603-PHILLIPS]
R121  2k2  [R0603-PHILLIPS]
R125  ??  [R0603-PHILLIPS]
T1  TC1-1-13MG2  [AT224-1]
T2  TC1-1-13MG2  [AT224-1]
T3  TC4-25+  [AT224-1]
TST1  (no value)  [kp40x40]
TST2  (no value)  [kp40x40]
TST3  RX_CLK_O  [kp40x40]
TST4  AUX_IN  [kp40x40]
TST5  RX_Ip  [kp40x40]
TST6  RX_In  [kp40x40]
TST7  RX_Qp  [kp40x40]
TST8  RX_Qn  [kp40x40]
U12  LMS6002D  [DQFN120(9x9/0.5mm)]  (parts A,B,C,D of 4)
U14  SPF-5043Z  [SOT-343[2X1.25]]
U29  LD1117DT33  [to-252]
U30  LD1117S  [SOT-223-1]
U31  LD1117S  [SOT-223-1]
U32  LD1117S  [SOT-223-1]
Z1  NFM3DPC223R1H3  [NFM3DP]

### Ports
CLK_PLL (in), CLK_TRX (in), LMS_nRST (in), MISO (out), MOSI (bidir), RX, RXD0 (out), RXD1 (out), RXD2 (out), RXD3 (out), RXD4 (out), RXD5 (out), RXD6 (out), RXD7 (out), RXD8 (out), RXD9 (out), RXD10 (out), RXD11 (out), RXIQSEL (out), SCLK (in), SCN, SEN (in), TX, TXD0 (in), TXD1 (in), TXD2 (in), TXD3 (in), TXD4 (in), TXD5 (in), TXD6 (in), TXD7 (in), TXD8 (in), TXD9 (in), TXD10 (in), TXD11 (in), TXIQSEL (in)

### Nets
+5V: C67.2 C100.2 L34.1
+6V: C44.1 Z1.1
GND: C44.2 C45.1 C46.2 C47.2 C48.2 C49.2 C50.2 C51.2(-) C52.2(-) C53.2(-) C54.2(-) C55.2 C56.2 C57.2 C58.2 C59.1 C60.1 C61.1 C62.1 C63.1 C64.2(-) C65.2(-) C66.2(-) C67.1 C68.2 C69.2 C70.2 C71.2 C72.2 C73.2 C74.2 C75.2 C76.2 C77.2 C78.2 C79.2 C80.2 C81.2 C82.2 C84.1 C85.1 C86.2 C87.2 C88.2 C89.2 C90.2 C91.2 C92.2 C93.2 C94.1 C95.2 C97.1 C98.2 C100.1 C169.2(-) ESD3.1(A1) ESD4.1(A1) ESD5.1(A1) R96.1 R97.1 R98.1 R106.1 R107.1 R108.1 R110.1 R111.1 R112.1 R113.1 R121.2 T1.6(Pri_Dot) T2.4(Pri) T3.2(Sec_CT) T3.6(Pri_Dot) U12.0(GND) U12.53(UNUSED) U12.55(UNUSED) U12.88(UNUSED) U12.93(UNUSED) U12.97(RXIN1EP) U12.99(RXIN1EN) U14.2(GND) U14.4(GND) U29.1(GND) Z1.2
+1,8VALMS: C72.1 C169.1(+) L14.1 L15.1 R101.2 U32.2(Vout)
+1,8VDLMS: C66.1(+) C71.1 L11.2 L16.2 L18.2 L19.2 L20.2 R100.2 U31.2(Vout)
+2,5VLMS: C65.1(+) C68.1 C70.1 R99.2 R103.1 U12.66(TXEN) U12.76(RXEN) U30.2(Vout)
+3,3VLMS: C64.1(+) C69.1 L12.1 L13.1 L17.1 L21.2 L22.1 L23.2 L24.1 L25.2 L26.1 L27.2 L28.1 L29.2 R95.2 U29.2(Vout)
CLK_PLL: L6.1 ; port CLK_PLL
CLK_TRX: R80.1 ; port CLK_TRX
LMS_nRST: R95.1 U12.75(~{RESET}) ; port LMS_nRST
MISO: U12.68(SDO) ; port MISO
MOSI: U12.69(SDIO) ; port MOSI
RX: C111.1 ESD4.2(A2) ; port RX
RXD0: U12.15(RXD0) ; port RXD0
RXD1: U12.14(RXD1) ; port RXD1
RXD2: U12.13(RXD2) ; port RXD2
RXD3: U12.10(RXD3) ; port RXD3
RXD4: U12.11(RXD4) ; port RXD4
RXD5: U12.8(RXD5) ; port RXD5
RXD6: U12.9(RXD6) ; port RXD6
RXD7: U12.6(RXD7) ; port RXD7
RXD8: U12.5(RXD8) ; port RXD8
RXD9: U12.4(RXD9) ; port RXD9
RXD10: U12.3(RXD10) ; port RXD10
RXD11: U12.2(RXD11) ; port RXD11
RXIQSEL: U12.16(RXIQSEL) ; port RXIQSEL
SCLK: U12.70(SCLK) ; port SCLK
SCN: C112.2 ESD5.2(A2) ; port SCN
SEN: U12.67(SEN) ; port SEN
TX: C109.2 C110.2 ESD3.2(A2) ; port TX
TXD0: U12.21(TXD0) ; port TXD0
TXD1: U12.22(TXD1) ; port TXD1
TXD2: U12.23(TXD2) ; port TXD2
TXD3: U12.24(TXD3) ; port TXD3
TXD4: U12.25(TXD4) ; port TXD4
TXD5: U12.26(TXD5) ; port TXD5
TXD6: U12.27(TXD6) ; port TXD6
TXD7: U12.28(TXD7) ; port TXD7
TXD8: U12.29(TXD8) ; port TXD8
TXD9: U12.30(TXD9) ; port TXD9
TXD10: U12.31(TXD10) ; port TXD10
TXD11: U12.32(TXD11) ; port TXD11
TXIQSEL: U12.20(TXIQSEL) ; port TXIQSEL
NetC45_2: C45.2 C146.1 L6.2
NetC46_1: C46.1 C47.1 C48.1 C49.1 C50.1 L7.1 L8.1 L9.1 L10.1 Z1.3
NetC51_1: C51.1(+) C55.1 L7.2 U29.3(Vin)
NetC52_1: C52.1(+) C56.1 L8.2 U30.3(Vin)
NetC53_1: C53.1(+) C57.1 L9.2 U31.3(Vin)
NetC54_1: C54.1(+) C58.1 L10.2 U32.3(Vin)
NetC59_2: C59.2 L19.1 U12.61(TXVCCPLL18)
NetC60_2: C60.2 L18.1 R104.1 R105.1
NetC61_2: C61.2 L16.1 U12.83(RXVCCPLL18)
NetC62_2: C62.2 L11.1 U12.35(RAVDD18)
NetC63_2: C63.2 L20.1 U12.33(RDVDD18) U12.36(TDVDD18)
NetC73_1: C73.1 C78.1 L14.2 U12.60(TXVDDVCO18)
NetC74_1: C74.1 L12.2 U12.37(TAVDD33)
NetC75_1: C75.1 C79.1 L15.2 U12.84(RXVDDVCO18)
NetC76_1: C76.1 L17.2 U12.7(PVDDVGG)
NetC77_1: C77.1 R103.2 U12.34(PVDDAD33D)
NetC80_1: C80.1 L13.2 U12.74(PVDDSPI33)
NetC81_1: C81.1 U12.1(PVDDAD33A)
NetC82_1: C82.1 C83.1 R109.1 U12.64(TXCPOUT)
NetC83_2: C83.2 R106.2
NetC84_2: C84.2 R109.2 U12.57(TXVTUNE)
NetC85_2: C85.2 U12.38(VREFAD)
NetC86_1: C86.1 L21.1 U12.111(RXVCCLPF33) U12.112(RXVCCVGA33)
NetC87_1: C87.1 L22.2 U12.58(TXPVDDPLL33A)
NetC88_1: C88.1 L23.1 U12.107(RXPVDD33) U12.109(RXVCCTIA33)
NetC89_1: C89.1 L24.2 U12.59(TXVCCVCO33) U12.62(TXPVDDPLL33B) U12.63(TXVCCHP33)
NetC90_1: C90.1 L25.1 U12.90(RXVCCMIX33) U12.101(RXVCCLNA33)
NetC91_1: C91.1 L26.2 U12.78(RXVCCCHP33) U12.79(RXVCCLOB33) U12.81(RXPVDDPLL33B) U12.82(RXVCCVCO33) U12.85(RXVCCPLL33)
NetC92_1: C92.1 L27.1 U12.43(TXVCCLPF33) U12.45(TXVCCMIX33) U12.47(TXPVDD33) U12.49(TXVCCDRV33)
NetC93_1: C93.1 L28.2 U12.86(RXPVDDPLL33A)
NetC94_2: C94.2 C95.1 L29.1 L30.1 L31.1
NetC96_1: C96.1 C105.1 L31.2 U12.46(TXOUT2N)
NetC96_2: C96.2 C104.1 L30.2 U12.44(TXOUT2P)
NetC97_2: C97.2 R119.1 U12.87(RXVTUNE)
NetC98_1: C98.1 C99.1 R119.2 U12.80(RXCPOUT)
NetC99_2: C99.2 R121.1
NetC101_1: C101.1 C108.1 T1.4(Pri)
NetC101_2: C101.2 U14.3(IN)
NetC102_1: C102.1 U12.108(RXIN3P)
NetC102_2: C102.2 L32.1
NetC103_1: C103.1 U12.110(RXIN3N)
NetC103_2: C103.2 L33.1
NetC104_2: C104.2 T1.3(Sec_Dot)
NetC105_2: C105.2 T1.1(Sec)
NetC106_1: C106.1 U12.96(RXIN1P)
NetC106_2: C106.2 T2.1(Sec)
NetC107_1: C107.1 U12.98(RXIN1N)
NetC107_2: C107.2 T2.3(Sec_Dot)
NetC108_2: C108.2 C109.1
NetC110_1: C110.1 L34.2 U14.1(OUT)
NetC111_2: C111.2 T2.6(Pri_Dot)
NetC112_1: C112.1 T3.4(Pri)
NetC146_2: C146.2 U12.71(PLLCLK)
NetL32_2: L32.2 T3.1(Sec)
NetL33_2: L33.2 T3.3(Sec_Dot)
NetR80_2: R80.2 U12.17(RXCLK) U12.19(TXCLK)
NetR96_2: R96.2 R99.1 U30.1(ADJ)
NetR97_2: R97.2 R100.1 U31.1(ADJ)
NetR98_2: R98.2 R101.1 U32.1(ADJ)
NetR104_2: R104.2 U12.72(TRXVDDDSM18)
NetR105_2: R105.2 U12.73(VSPI18)
NetR107_2: R107.2 R114.1
NetR108_2: R108.2 U12.89(XRES12k)
NetR110_2: R110.2 U12.52(TXINIP)
NetR111_2: R111.2 U12.51(TXININ)
NetR112_2: R112.2 U12.54(TXINQP)
NetR113_2: R113.2 U12.56(TXINQN)
NetR114_2: R114.2 U12.39(XRESAD)
NetR125_1: R125.1 U12.100(RXIN2P)
NetR125_2: R125.2 U12.102(RXIN2N)
NetTST1_1: TST1.1 U12.65(TSTD_OUT1)
NetTST2_1: TST2.1 U12.77(TSTD_OUT2)
NetTST3_1: TST3.1 U12.41(PLLCLK_OUT)
NetTST4_1: TST4.1 U12.42(AUXIN/ATPOUT)
NetTST5_1: TST5.1 U12.116(RXOUTIP)
NetTST6_1: TST6.1 U12.115(RXOUTIN)
NetTST7_1: TST7.1 U12.113(RXOUTQP)
NetTST8_1: TST8.1 U12.114(RXOUTQN)

Not connected (* = marked no-connect by the designer): U12 12(PVDDAD33B)* 18(PVDDAD33C)* 40(RXCLK_OUT)* 48(TXOUT1P)* 50(TXOUT1N)* 91(OEXLNA1P)* 92(IEXMIX1P)* 94(IEXMIX1N)* 95(OEXLNA1N)* 103(OEXLNA2P)* 104(IEXMIX2P)* 105(OEXLNA2N)* 106(IEXMIX2N)*

### Channels
LMS-a: designators end in -1; ports CLK_PLL=CLK_PLL1 CLK_TRX=CLK_TRX1 LMS_nRST=LMS1_nRST MISO=MISO1 MOSI=MOSI1 RX=RX RXD0=RX1D0 RXD1=RX1D1 RXD2=RX1D2 RXD3=RX1D3 RXD4=RX1D4 RXD5=RX1D5 RXD6=RX1D6 RXD7=RX1D7 RXD8=RX1D8 RXD9=RX1D9 RXD10=RX1D10 RXD11=RX1D11 RXIQSEL=RX1IQSEL SCLK=SCLK1 SCN=SCN SEN=SEN1 TX=TX TXD0=TX1D0 TXD1=TX1D1 TXD2=TX1D2 TXD3=TX1D3 TXD4=TX1D4 TXD5=TX1D5 TXD6=TX1D6 TXD7=TX1D7 TXD8=TX1D8 TXD9=TX1D9 TXD10=TX1D10 TXD11=TX1D11 TXIQSEL=TX1IQSEL
LMS-b: designators end in -2; ports CLK_PLL=CLK_PLL2 CLK_TRX=CLK_TRX2 LMS_nRST=LMS2_nRST MISO=MISO2 MOSI=MOSI2 RX=RX RXD0=RX2D0 RXD1=RX2D1 RXD2=RX2D2 RXD3=RX2D3 RXD4=RX2D4 RXD5=RX2D5 RXD6=RX2D6 RXD7=RX2D7 RXD8=RX2D8 RXD9=RX2D9 RXD10=RX2D10 RXD11=RX2D11 RXIQSEL=RX2IQSEL SCLK=SCLK2 SCN=SCN SEN=SEN2 TX=TX TXD0=TX2D0 TXD1=TX2D1 TXD2=TX2D2 TXD3=TX2D3 TXD4=TX2D4 TXD5=TX2D5 TXD6=TX2D6 TXD7=TX2D7 TXD8=TX2D8 TXD9=TX2D9 TXD10=TX2D10 TXD11=TX2D11 TXIQSEL=TX2IQSEL

### Notes on the sheet
- (See Clocking.SchDoc)
- (in symbol CA3216) A
- (in symbol CD7343) D

### Library data of the parts
C44 C46-C50 C55-C63 C67 C69-C72 C78-C80 C85-C94 = C0402: as C113 on sheet PwrAndBias; Value: 0.1
C45 C82-C84 C95-C112 C146 = C0603: as C128 on sheet PwrAndBias
  C45 C82 C95 C98 C100-C107 C110-C112: Value: 100p
  C83 C99: Value: 1500p
  C84 C97: Value: 33p
  C96: Value: ?
  C108 C109: Value: ??
  C146: Value: 0.01
C51-C54 = CD7343: Конденсатор; Manufacturer: SPRAGUE; Name: CASE-G; U/P/TKE: 16V; Value: 100uF
C64-C66 = CA3216: Конденсатор; Manufacturer: SPRAGUE; Name: Case A; U/P/TKE: 16V; Value: 10uF
C68 C73-C77 C81 = C0603: Конденсатор; Manufacturer: MURATA; Tolerance: 20%; Name: SMD0603; U/P/TKE: Y5V
  C68 C74 C76 C77 C81: Value: 1.0
  C73 C75: Value: 10.0
C169 = CD7343: as C131 on sheet PwrAndBias; Value: 330uF
ESD3-ESD5 = SESD0402X: ESD diod bi-directional; Manufacturer: Tyco Electronics Corp; U/P/TKE: 9.8V; Name: SESD0402X1BN-0010-098
L6-L29 = TI160808: Дроссель ЭМС; Manufacturer: MURATA
  L6: Name: R0603
  L7-L29: Name: TI160808U601; Value: *
L30-L34 = TF160808: Индуктивность; Manufacturer: SMD; Name: TF160808
  L30 L31 L34: Value: 39nH
  L32 L33: Value: 4,7nH
R80 R95-R101 R103-R114 R119 R121 R125 = R0603: as R175 on sheet Total
  R80 R105: Value: 10
  R95: Value: 1k
  R96 R99-R101: Value: 120
  R97 R98: Value: 56
  R103: Value: 270
  R104: Value: 150
  R106 R121: Value: 2k2
  R107: Value: 390
  R108: Value: 12k
  R109 R119: Value: 3k3
  R110-R113: Value: 51
  R114: Value: 6k8
  R125: Value: ??
T1 T2 = TC1-1-13: Трансформатор; Manufacturer: Mini-Cirquits; PDF: d:\Proj\Components\Mini-Circuits\TC1-1-13MG2+.pdf; Misc: RF Transformer; Name: TC1-1-13MG2
T3 = TC4-25: Трансформатор; Manufacturer: Mini-Cirquits; PDF: d:\Proj\Components\Mini-Circuits\TC4-25+.pdf; Misc: RF Transformer; Name: TC4-25+
TST1-TST8 = KP: Контактная площадка; Manufacturer: Конструктив
  TST3: Name: RX_CLK_O
  TST4: Name: AUX_IN
  TST5: Name: RX_Ip
  TST6: Name: RX_In
  TST7: Name: RX_Qp
  TST8: Name: RX_Qn
U12 = LMS6002D: Микросхема; Manufacturer: Lime Microsystems; Misc: Multi-band Multi-standard  Transceiver with Digital Interface; Name: LMS6002D
U14 = SPF-5043Z: Микросхема; Manufacturer: RFMD; Swap: No; PDF: D:\Proj\Components\Sirenza\SPF-5043Z_Datasheet.pdf; Name: SPF-5043Z
U29 = LD1117FIX: Микросхема; Manufacturer: STMicro; Swap: No; Name: LD1117DT33
U30-U32 = LD1117ADJ: as U17 on sheet PwrAndBias; Name: LD1117S
Z1 = NFM3DP: Фильтр; Manufacturer: Murata; Misc: Фильтр электромагнитных помех; Value: 0.022uF; PDF: D:\DataSheets\MuRata\EMI_FILTERS.pdf; Name: NFM3DPC223R1H3

## Nets that join several sheets
+5V: LMS-a (C67-1.2 C100-1.2 L34-1.1), LMS-b (C67-2.2 C100-2.2 L34-2.1)
+6V: Total (X12.16), PwrAndBias (C125.1 L44.2), LMS-a (C44-1.1 Z1-1.1), LMS-b (C44-2.1 Z1-2.1)
GND: Total (12 pins), PwrAndBias (245 pins), LMS-a (84 pins), LMS-b (84 pins)
RX: Total (X9.1), LMS-a (C111-1.1 ESD4-1.2)
RX: Total (X10.1), LMS-b (C111-2.1 ESD4-2.2)
SCN: Total (X14.1), LMS-a (C112-1.2 ESD5-1.2)
SCN: Total (X15.1), LMS-b (C112-2.2 ESD5-2.2)
TX: Total (X8.1), LMS-a (C109-1.2 C110-1.2 ESD3-1.2)
TX: Total (X11.1), LMS-b (C109-2.2 C110-2.2 ESD3-2.2)

## Assembly variants
UmTRXv2_2U_20dBm_TCXO: not fitted C45-1 C45-2 C96-1 C96-2 C108-1 C108-2 C109-1 C109-2 LED1A' LED1B' LED1C' LED2A' LED2B' LED2C' LED3A' LED3B' LED3C' R2 R6 R10 R12 R52 R53 R54 R62 R79 R81 R82 R83 R84 R85 R86 R87 R88 R125-1 R125-2 R158 R172 R175 U2 U6 X2-1 X2-2 X6' X13' X16
UmTRXv2_20dBm_TCXO: not fitted C45-1 C45-2 C96-1 C96-2 C108-1 C108-2 C109-1 C109-2 LED1 LED2 LED3 R2 R6 R10 R12 R52 R53 R54 R62 R79 R81 R82 R83 R84 R85 R86 R87 R88 R125-1 R125-2 R158 R172 R175 U2 U6 X2-1 X2-2 X6' X13' X16
UmTRXv2_empty: not fitted C4 C5 C6 C7 C8 C9 C10 C11 C12 C13 C14 C15 C17 C18 C19 C20 C21 C22 C24 C25 C26 C27 C32 C33 C34 C35 C36 C37 C38 C39 C40 C41 C42 C43 C44-1 C44-2 C45-1 C45-2 C46-1 C46-2 C47-1 C47-2 C48-1 C48-2 C49-1 C49-2 C50-1 C50-2 C51-1 C51-2 C52-1 C52-2 C53-1 C53-2 C54-1 C54-2 C55-1 C55-2 C56-1 C56-2 C57-1 C57-2 C58-1 C58-2 C59-1 C59-2 C60-1 C60-2 C61-1 C61-2 C62-1 C62-2 C63-1 C63-2 C64-1 C64-2 C65-1 C65-2 C66-1 C66-2 C67-1 C67-2 C68-1 C68-2 C69-1 C69-2 C70-1 C70-2 C71-1 C71-2 C72-1 C72-2 C73-1 C73-2 C74-1 C74-2 C75-1 C75-2 C76-1 C76-2 C77-1 C77-2 C78-1 C78-2 C79-1 C79-2 C80-1 C80-2 C81-1 C81-2 C82-1 C82-2 C83-1 C83-2 C84-1 C84-2 C85-1 C85-2 C86-1 C86-2 C87-1 C87-2 C88-1 C88-2 C89-1 C89-2 C90-1 C90-2 C91-1 C91-2 C92-1 C92-2 C93-1 C93-2 C94-1 C94-2 C95-1 C95-2 C96-1 C96-2 C97-1 C97-2 C98-1 C98-2 C99-1 C99-2 C100-1 C100-2 C101-1 C101-2 C102-1 C102-2 C103-1 C103-2 C104-1 C104-2 C105-1 C105-2 C106-1 C106-2 C107-1 C107-2 C108-1 C108-2 C109-1 C109-2 C110-1 C110-2 C111-1 C111-2 C112-1 C112-2 C113 C114 C115 C116 C117 C118 C119 C120 C125 C127 C128 C129 C131 C132 C133 C135 C136 C137 C138 C139 C140 C141 C143 C144 C145 C146 C146-1 C146-2 C147 C148 C150 C151 C152 C153 C154 C156 C157 C158 C159 C161 C162 C163 C164 C165 C166 C167 C168 C169-1 C169-2 C171 C172 C174 C175 C176 C177 C178 C179 C180 C181 C182 C183 C184 C185 C186 C187 C188 C189 C190 C191 C192 C193 C194 C196 C197 C198 C199 C200 C201 C202 C203 C204 C205 C206 C207 C208 C209 C210 C211 C212 C213 C214 C215 C216 C217 C218 C219 C220 C221 C222 C223 C224 C225 C227 C228 C229 C230 C231 C232 C233 C234 C235 C236 C237 C238 C239 C240 C241 C242 C243 C244 C245 C246 C247 C248 C249 C250 C251 C252 C254 C255 C256 C257 C258 C259 C260 C261 C262 C263 C264 C265 C266 C267 C268 C269 C270 C271 C272 C273 C274 C275 C276 C277 C278 C279 C280 C281 C282 C283 C284 C285 C286 C287 C289 C290 C291 C292 C293 C294 C295 C296 C297 C298 C299 C300 D1 D2 D3 D4 ESD1 ESD2 ESD3 ESD3-1 ESD3-2 ESD4-1 ESD4-2 ESD5-1 ESD5-2 F1 L1 L2 L3 L4 L5 L6-1 L6-2 L7-1 L7-2 L8-1 L8-2 L9-1 L9-2 L10-1 L10-2 L11-1 L11-2 L12-1 L12-2 L13-1 L13-2 L14-1 L14-2 L15-1 L15-2 L16-1 L16-2 L17-1 L17-2 L18-1 L18-2 L19-1 L19-2 L20-1 L20-2 L21-1 L21-2 L22-1 L22-2 L23-1 L23-2 L24-1 L24-2 L25-1 L25-2 L26-1 L26-2 L27-1 L27-2 L28-1 L28-2 L29-1 L29-2 L30-1 L30-2 L31-1 L31-2 L32-1 L32-2 L33-1 L33-2 L34-1 L34-2 L35 L36 L37 L40 L41 L42 L43 L44 L45 L46 LED1 LED1A' LED1B' LED1C' LED2 LED2A' LED2B' LED2C' LED3 LED3A' LED3B' LED3C' LED4 LED5 LED6 Q1 Q2 Q3 Q4 R1 R2 R3 R4 R5 R6 R7 R8 R9 R10 R11 R12 R13 R14 R15 R16 R17 R18 R19 R20 R21 R22 R23 R24 R26 R27 R28 R29 R30 R31 R32 R33 R34 R35 R36 R37 R38 R41 R42 R43 R44 R45 R46 R47 R48 R49 R50 R51 R52 R53 R54 R55 R56 R57 R58 R59 R60 R61 R62 R63 R64 R65 R66 R67 R78 R79 R80-1 R80-2 R81 R82 R83 R84 R85 R86 R87 R88 R89 R90 R91 R92 R93 R94 R95-1 R95-2 R96-1 R96-2 R97-1 R97-2 R98-1 R98-2 R99-1 R99-2 R100-1 R100-2 R101-1 R101-2 R103-1 R103-2 R104-1 R104-2 R105-1 R105-2 R106-1 R106-2 R107-1 R107-2 R108-1 R108-2 R109-1 R109-2 R110-1 R110-2 R111-1 R111-2 R112-1 R112-2 R113-1 R113-2 R114-1 R114-2 R119-1 R119-2 R121-1 R121-2 R122 R123 R124 R125-1 R125-2 R128 R129 R131 R132 R133 R134 R135 R136 R137 R138 R149 R152 R153 R154 R155 R156 R157 R158 R159 R162 R163 R164 R165 R166 R168 R169 R170 R171 R172 R173 R174 R175 RA1 RA2 RA3 S1 S2 S3 T1-1 T1-2 T2-1 T2-2 T3-1 T3-2 TST1-1 TST1-2 TST2-1 TST2-2 TST3-1 TST3-2 TST4-1 TST4-2 TST5-1 TST5-2 TST6-1 TST6-2 TST7-1 TST7-2 TST8-1 TST8-2 TST9 TST10 TST11 TST12 TST13 TST14 TST15 TST16 U1 U2 U3 U4 U5 U6 U6A U7 U8 U9 U10 U11 U12-1 U12-2 U14-1 U14-2 U15 U16 U17 U18 U26 U27 U28 U29-1 U29-2 U30-1 U30-2 U31-1 U31-2 U32-1 U32-2 U33 U34 U35 U36 U37 X1 X2-1 X2-2 X3 X4 X5 X6 X6' X7 X8 X9 X10 X11 X12 X13 X13' X14 X15 X16 X17 X18 Z1-1 Z1-2
UmTRXv2_full_assembly: all parts fitted